# Altium project ARMflash_revC.PrjPcb (part 3 of 4)

## Sheet Pg13_FPGA_Connectors.SchDoc: FPGA CONNECTORS
size A2; DocumentNumber: 13; Revision: C2; SheetNumber: 13; SheetTotal: 16
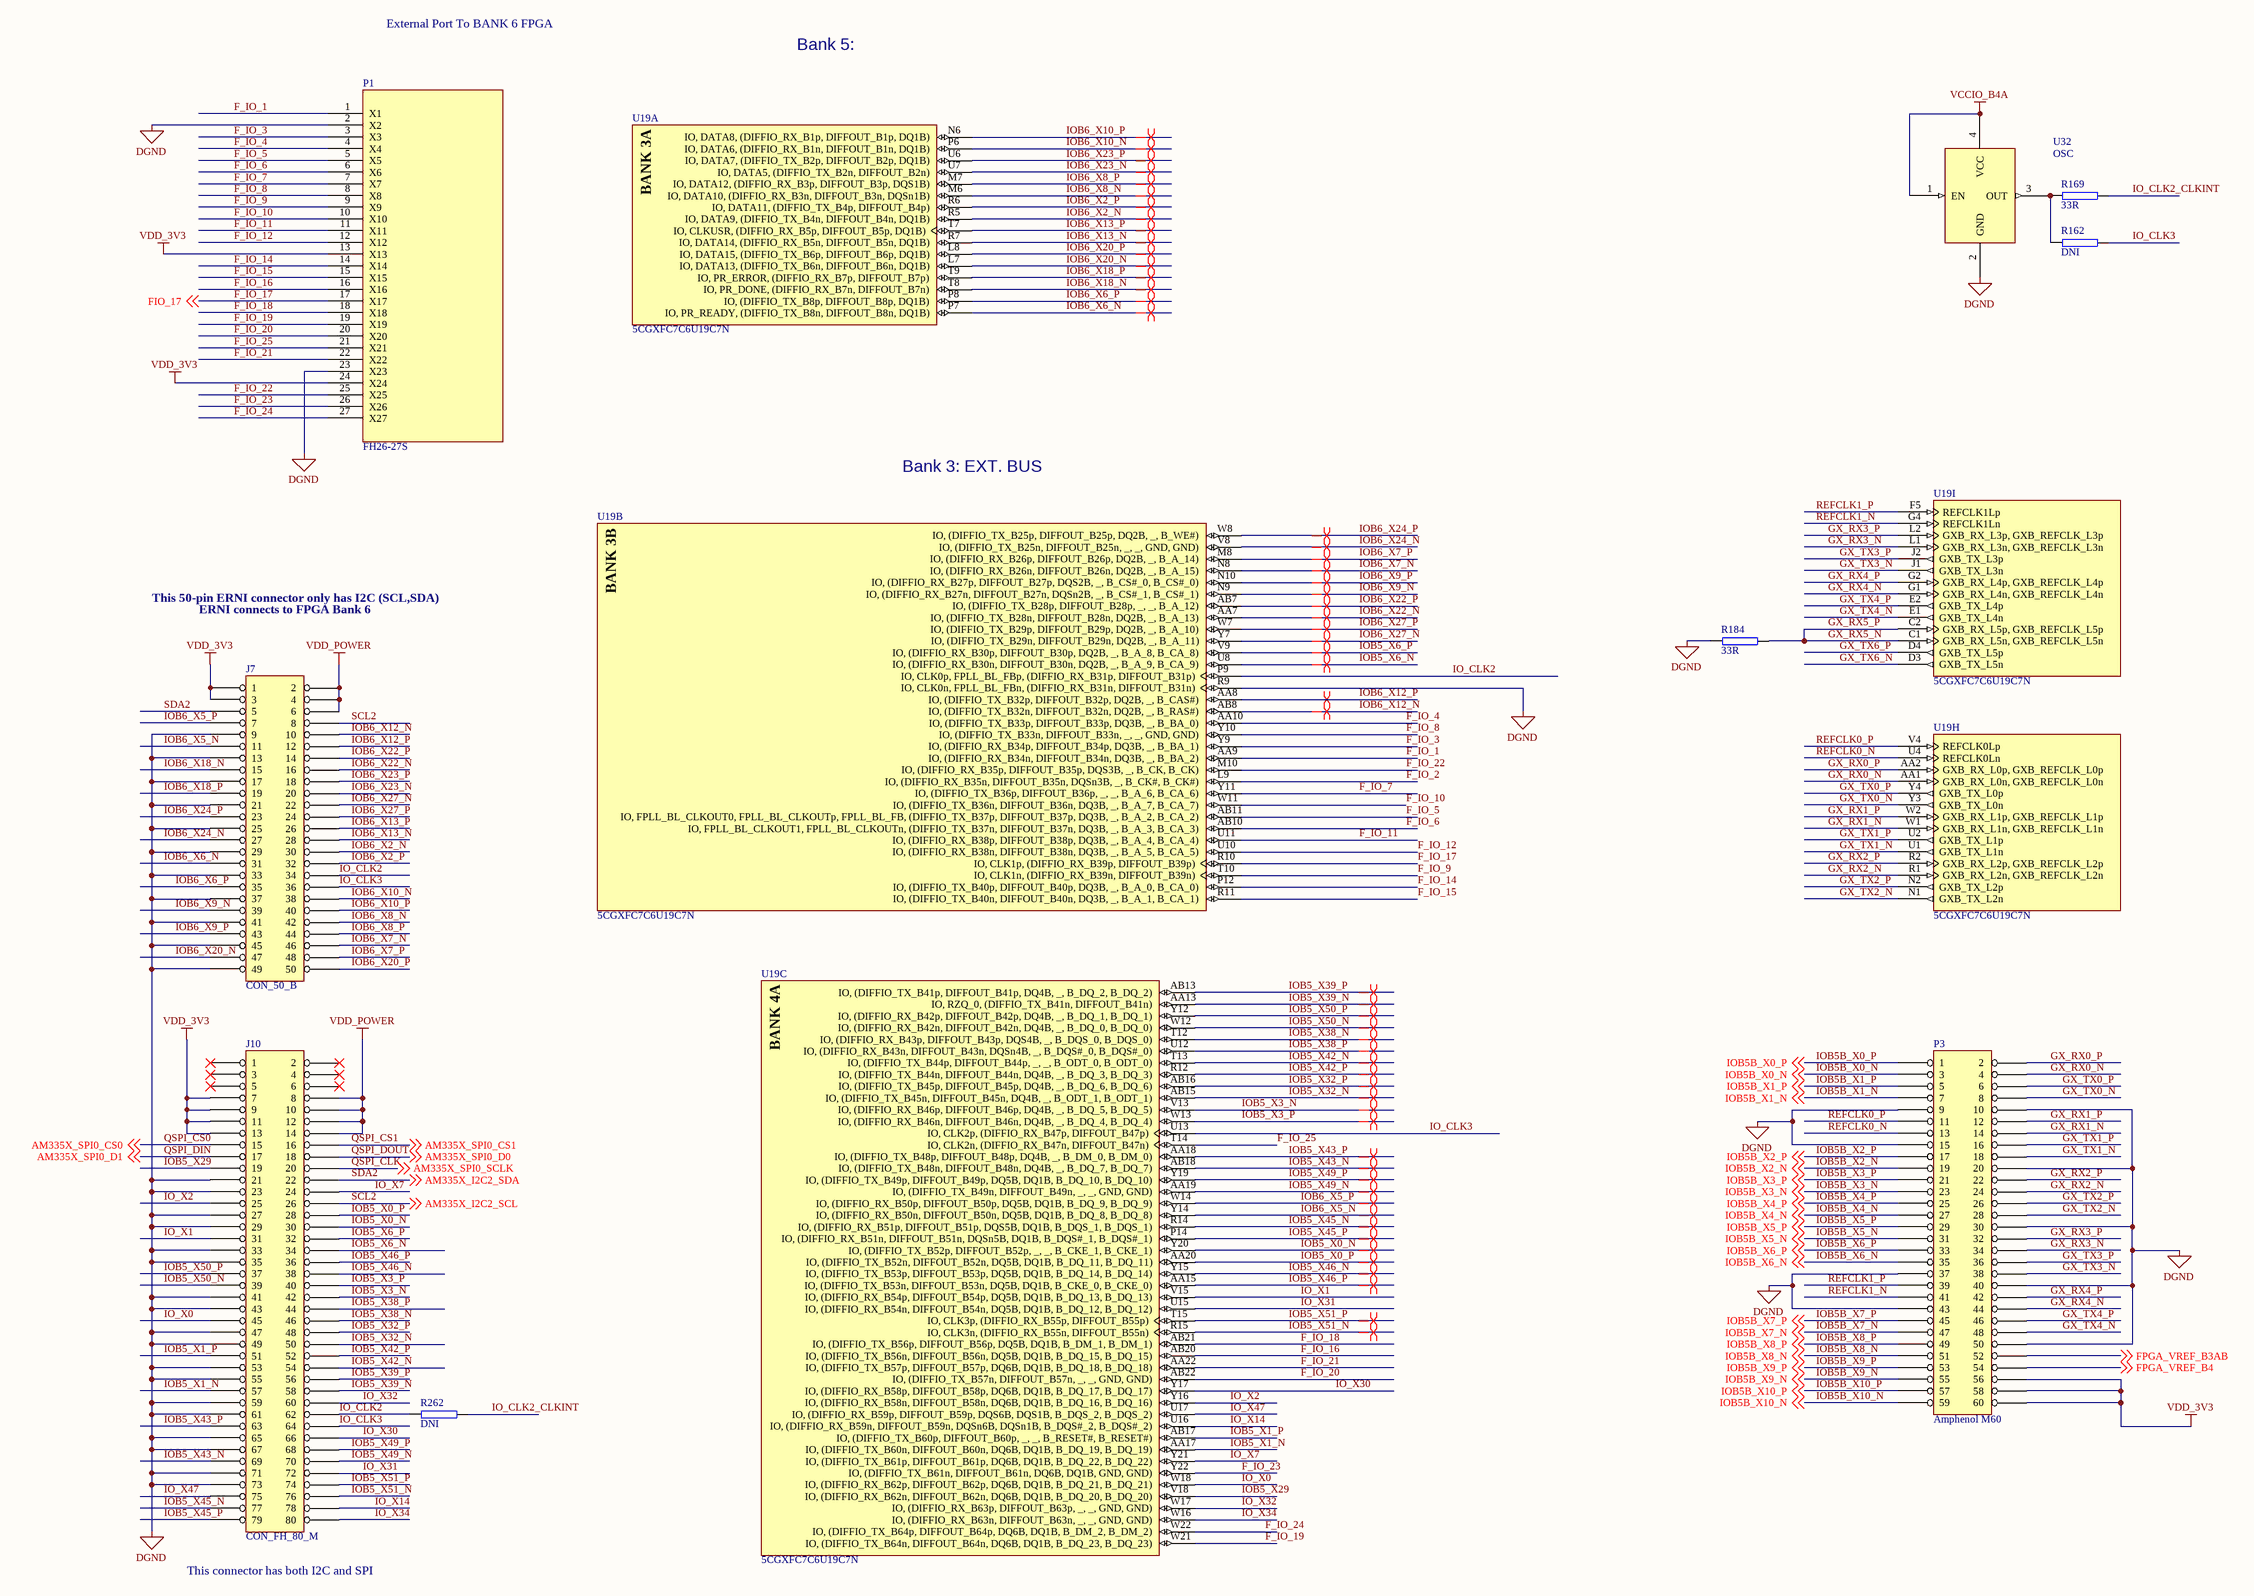
[diagram p15: Pg13_FPGA_Connectors.SchDoc]

### Parts
(Parts that share a designator on the sheet are numbered #1, #2 ... from top to bottom, then left to right.)
?#13  (no value)  (graphical)
J7  CON_50_B  [CON_50_B]
J10  CON_FH_80_M  [CON_FH_80_M]
P1  FH26-27S  [FH26-27S]
P3  Amphenol M60  [CON60_M]
R162  DNI  [sc0402]
R169  33R  [sc0402]
R184  33R  [sc0402]
R262  DNI  [sc0402]
U19  5CGXFC7C6U19C7N  [ALTR-UBGA484_A-190]  (parts A,B,C,H,I of 13)
U32  OSC  [Osc 3.2x2.5]

### Nets
DGND: J7.9 J7.13 J7.17 J7.21 J7.25 J7.29 J7.33 J7.37 J7.41 J7.45 J7.49 J10.21 J10.23 J10.27 J10.29 J10.33 J10.35 J10.41 J10.43 J10.47 J10.49 J10.53 J10.55 J10.59 J10.61 J10.65 J10.67 J10.71 J10.73 P1.2(X2) P1.23(X23) P3.9 P3.10 P3.15 P3.20 P3.30 P3.37 P3.40 P3.43 P3.50 R184.1 U19.R9(IO,_CLK0n,_FPLL_BL_FBn,_(DIFFIO_RX_B31n,_DIFFOUT_B31n)) U32.2(GND)
VCCIO_B4A: U32.1(EN) U32.4(VCC)
VDD_3V3: J7.1 J7.3 J10.7 J10.9 J10.11 J10.13 P1.13(X13) P1.24(X24) P3.56 P3.58 P3.60  [project net VDD]
VDD_POWER: J7.2 J7.4 J7.6 J10.8 J10.10 J10.12 J10.14
AM335X_SPI0_CS0: J10.15 ; off-sheet AM335X_SPI0_CS0  [also labelled QSPI_CS0]
AM335X_SPI0_CS1: J10.16 ; off-sheet AM335X_SPI0_CS1  [also labelled QSPI_CS1]
AM335X_SPI0_D0: J10.18 ; off-sheet AM335X_SPI0_D0  [also labelled QSPI_DOUT]
AM335X_SPI0_D1: J10.17 ; off-sheet AM335X_SPI0_D1  [also labelled QSPI_DIN]
AM335X_SPI0_SCLK: J10.20 ; off-sheet AM335X_SPI0_SCLK  [also labelled QSPI_CLK]
F_IO_1: P1.1(X1) U19.AA9(IO,_(DIFFIO_RX_B34n,_DIFFOUT_B34n,_DQ3B,__,_B_BA_2))
F_IO_2: U19.L9(IO,_(DIFFIO_RX_B35n,_DIFFOUT_B35n,_DQSn3B,__,_B_CK#,_B_CK#))
F_IO_3: P1.3(X3) U19.Y9(IO,_(DIFFIO_RX_B34p,_DIFFOUT_B34p,_DQ3B,__,_B_BA_1))
F_IO_4: P1.4(X4) U19.AA10(IO,_(DIFFIO_TX_B33p,_DIFFOUT_B33p,_DQ3B,__,_B_BA_0))
F_IO_5: P1.5(X5) U19.AB11(IO,_FPLL_BL_CLKOUT0,_FPLL_BL_CLKOUTp,_FPLL_BL_FB,_(DIFFIO_TX_B37p,_DIFFOUT_B37p,_DQ3B,__,_B_A_2,_B_CA_2))
F_IO_6: P1.6(X6) U19.AB10(IO,_FPLL_BL_CLKOUT1,_FPLL_BL_CLKOUTn,_(DIFFIO_TX_B37n,_DIFFOUT_B37n,_DQ3B,__,_B_A_3,_B_CA_3))
F_IO_7: P1.7(X7) U19.Y11(IO,_(DIFFIO_TX_B36p,_DIFFOUT_B36p,__,__,_B_A_6,_B_CA_6))
F_IO_8: P1.8(X8) U19.Y10(IO,_(DIFFIO_TX_B33n,_DIFFOUT_B33n,__,__,_GND,_GND))
F_IO_9: P1.9(X9) U19.T10(IO,_CLK1n,_(DIFFIO_RX_B39n,_DIFFOUT_B39n))
F_IO_10: P1.10(X10) U19.W11(IO,_(DIFFIO_TX_B36n,_DIFFOUT_B36n,_DQ3B,__,_B_A_7,_B_CA_7))
F_IO_11: P1.11(X11) U19.U11(IO,_(DIFFIO_RX_B38p,_DIFFOUT_B38p,_DQ3B,__,_B_A_4,_B_CA_4))
F_IO_12: P1.12(X12) U19.U10(IO,_(DIFFIO_RX_B38n,_DIFFOUT_B38n,_DQ3B,__,_B_A_5,_B_CA_5))
F_IO_14: P1.14(X14) U19.P12(IO,_(DIFFIO_TX_B40p,_DIFFOUT_B40p,_DQ3B,__,_B_A_0,_B_CA_0))
F_IO_15: P1.15(X15) U19.R11(IO,_(DIFFIO_TX_B40n,_DIFFOUT_B40n,_DQ3B,__,_B_A_1,_B_CA_1))
F_IO_16: P1.16(X16) U19.AB20(IO,_(DIFFIO_TX_B56n,_DIFFOUT_B56n,_DQ5B,_DQ1B,_B_DQ_15,_B_DQ_15))
F_IO_17: P1.17(X17) U19.R10(IO,_CLK1p,_(DIFFIO_RX_B39p,_DIFFOUT_B39p)) ; off-sheet FIO_17  [also labelled FIO_17]
F_IO_18: P1.18(X18) U19.AB21(IO,_(DIFFIO_TX_B56p,_DIFFOUT_B56p,_DQ5B,_DQ1B,_B_DM_1,_B_DM_1))
F_IO_19: P1.19(X19) U19.W21(IO,_(DIFFIO_TX_B64n,_DIFFOUT_B64n,_DQ6B,_DQ1B,_B_DQ_23,_B_DQ_23))
F_IO_20: P1.20(X20) U19.AB22(IO,_(DIFFIO_TX_B57n,_DIFFOUT_B57n,__,__,_GND,_GND))
F_IO_21: P1.22(X22) U19.AA22(IO,_(DIFFIO_TX_B57p,_DIFFOUT_B57p,_DQ6B,_DQ1B,_B_DQ_18,_B_DQ_18))
F_IO_22: P1.25(X25) U19.M10(IO,_(DIFFIO_RX_B35p,_DIFFOUT_B35p,_DQS3B,__,_B_CK,_B_CK))
F_IO_23: P1.26(X26) U19.Y22(IO,_(DIFFIO_TX_B61n,_DIFFOUT_B61n,_DQ6B,_DQ1B,_GND,_GND))
F_IO_24: P1.27(X27) U19.W22(IO,_(DIFFIO_TX_B64p,_DIFFOUT_B64p,_DQ6B,_DQ1B,_B_DM_2,_B_DM_2))
F_IO_25: P1.21(X21) U19.T14(IO,_CLK2n,_(DIFFIO_RX_B47n,_DIFFOUT_B47n))
FPGA_VREF_B3AB: P3.52 ; off-sheet FPGA_VREF_B3AB
FPGA_VREF_B4: P3.54 ; off-sheet FPGA_VREF_B4
GX_RX0_N: P3.4 U19.AA1(GXB_RX_L0n,_GXB_REFCLK_L0n)
GX_RX0_P: P3.2 U19.AA2(GXB_RX_L0p,_GXB_REFCLK_L0p)
GX_RX1_N: P3.14 U19.W1(GXB_RX_L1n,_GXB_REFCLK_L1n)
GX_RX1_P: P3.12 U19.W2(GXB_RX_L1p,_GXB_REFCLK_L1p)
GX_RX2_N: P3.24 U19.R1(GXB_RX_L2n,_GXB_REFCLK_L2n)
GX_RX2_P: P3.22 U19.R2(GXB_RX_L2p,_GXB_REFCLK_L2p)
GX_RX3_N: P3.34 U19.L1(GXB_RX_L3n,_GXB_REFCLK_L3n)
GX_RX3_P: P3.32 U19.L2(GXB_RX_L3p,_GXB_REFCLK_L3p)
GX_RX4_N: P3.44 U19.G1(GXB_RX_L4n,_GXB_REFCLK_L4n)
GX_RX4_P: P3.42 U19.G2(GXB_RX_L4p,_GXB_REFCLK_L4p)
GX_RX5_N: R184.2 U19.C1(GXB_RX_L5n,_GXB_REFCLK_L5n) U19.C2(GXB_RX_L5p,_GXB_REFCLK_L5p)  [also labelled GX_RX5_P]
GX_TX0_N: P3.8 U19.Y3(GXB_TX_L0n)
GX_TX0_P: P3.6 U19.Y4(GXB_TX_L0p)
GX_TX1_N: P3.18 U19.U1(GXB_TX_L1n)
GX_TX1_P: P3.16 U19.U2(GXB_TX_L1p)
GX_TX2_N: P3.28 U19.N1(GXB_TX_L2n)
GX_TX2_P: P3.26 U19.N2(GXB_TX_L2p)
GX_TX3_N: P3.38 U19.J1(GXB_TX_L3n)
GX_TX3_P: P3.36 U19.J2(GXB_TX_L3p)
GX_TX4_N: P3.48 U19.E1(GXB_TX_L4n)
GX_TX4_P: P3.46 U19.E2(GXB_TX_L4p)
GX_TX6_N: U19.D3(GXB_TX_L5n)
GX_TX6_P: U19.D4(GXB_TX_L5p)
IO_CLK2: J7.34 J10.62 R262.1 U19.P9(IO,_CLK0p,_FPLL_BL_FBp,_(DIFFIO_RX_B31p,_DIFFOUT_B31p))
IO_CLK2_CLKINT: R169.2 R262.2
IO_CLK3: J7.36 J10.64 R162.2 U19.U13(IO,_CLK2p,_(DIFFIO_RX_B47p,_DIFFOUT_B47p))
IO_X0: J10.45 U19.W18(IO,_(DIFFIO_RX_B62p,_DIFFOUT_B62p,_DQ6B,_DQ1B,_B_DQ_21,_B_DQ_21))
IO_X1: J10.31 U19.V15(IO,_(DIFFIO_RX_B54p,_DIFFOUT_B54p,_DQ5B,_DQ1B,_B_DQ_13,_B_DQ_13))
IO_X2: J10.25 U19.Y16(IO,_(DIFFIO_RX_B58n,_DIFFOUT_B58n,_DQ6B,_DQ1B,_B_DQ_16,_B_DQ_16))
IO_X7: J10.24 U19.Y21(IO,_(DIFFIO_TX_B61p,_DIFFOUT_B61p,_DQ6B,_DQ1B,_B_DQ_22,_B_DQ_22))
IO_X14: J10.78 U19.U16(IO,_(DIFFIO_RX_B59n,_DIFFOUT_B59n,_DQSn6B,_DQSn1B,_B_DQS#_2,_B_DQS#_2))
IO_X30: J10.66 U19.Y17(IO,_(DIFFIO_RX_B58p,_DIFFOUT_B58p,_DQ6B,_DQ1B,_B_DQ_17,_B_DQ_17))
IO_X31: J10.72 U19.U15(IO,_(DIFFIO_RX_B54n,_DIFFOUT_B54n,_DQ5B,_DQ1B,_B_DQ_12,_B_DQ_12))
IO_X32: J10.60 U19.W17(IO,_(DIFFIO_RX_B63p,_DIFFOUT_B63p,__,__,_GND,_GND))
IO_X34: J10.80 U19.W16(IO,_(DIFFIO_RX_B63n,_DIFFOUT_B63n,__,__,_GND,_GND))
IO_X47: J10.75 U19.U17(IO,_(DIFFIO_RX_B59p,_DIFFOUT_B59p,_DQS6B,_DQS1B,_B_DQS_2,_B_DQS_2))
IOB5_X0_N: J10.30 U19.Y20(IO,_(DIFFIO_TX_B52p,_DIFFOUT_B52p,__,__,_B_CKE_1,_B_CKE_1))
IOB5_X0_P: J10.28 U19.AA20(IO,_(DIFFIO_TX_B52n,_DIFFOUT_B52n,_DQ5B,_DQ1B,_B_DQ_11,_B_DQ_11))
IOB5_X1_N: J10.57 U19.AA17(IO,_(DIFFIO_TX_B60n,_DIFFOUT_B60n,_DQ6B,_DQ1B,_B_DQ_19,_B_DQ_19))
IOB5_X1_P: J10.51 U19.AB17(IO,_(DIFFIO_TX_B60p,_DIFFOUT_B60p,__,__,_B_RESET#,_B_RESET#))
IOB5_X3_N: J10.42 U19.V13(IO,_(DIFFIO_RX_B46p,_DIFFOUT_B46p,_DQ4B,__,_B_DQ_5,_B_DQ_5))
IOB5_X3_P: J10.40 U19.W13(IO,_(DIFFIO_RX_B46n,_DIFFOUT_B46n,_DQ4B,__,_B_DQ_4,_B_DQ_4))
IOB5_X6_N: J10.34 U19.U8(IO,_(DIFFIO_RX_B30n,_DIFFOUT_B30n,_DQ2B,__,_B_A_9,_B_CA_9))
IOB5_X6_P: J10.32 U19.V9(IO,_(DIFFIO_RX_B30p,_DIFFOUT_B30p,_DQ2B,__,_B_A_8,_B_CA_8))
IOB5_X29: J10.19 U19.V18(IO,_(DIFFIO_RX_B62n,_DIFFOUT_B62n,_DQ6B,_DQ1B,_B_DQ_20,_B_DQ_20))
IOB5_X32_N: J10.50 U19.AB15(IO,_(DIFFIO_TX_B45n,_DIFFOUT_B45n,_DQ4B,__,_B_ODT_1,_B_ODT_1))
IOB5_X32_P: J10.48 U19.AB16(IO,_(DIFFIO_TX_B45p,_DIFFOUT_B45p,_DQ4B,__,_B_DQ_6,_B_DQ_6))
IOB5_X38_N: J10.46 U19.T12(IO,_(DIFFIO_RX_B43p,_DIFFOUT_B43p,_DQS4B,__,_B_DQS_0,_B_DQS_0))
IOB5_X38_P: J10.44 U19.U12(IO,_(DIFFIO_RX_B43n,_DIFFOUT_B43n,_DQSn4B,__,_B_DQS#_0,_B_DQS#_0))
IOB5_X39_N: J10.58 U19.AA13(IO,_RZQ_0,_(DIFFIO_TX_B41n,_DIFFOUT_B41n))
IOB5_X39_P: J10.56 U19.AB13(IO,_(DIFFIO_TX_B41p,_DIFFOUT_B41p,_DQ4B,__,_B_DQ_2,_B_DQ_2))
IOB5_X42_N: J10.54 U19.T13(IO,_(DIFFIO_TX_B44p,_DIFFOUT_B44p,__,__,_B_ODT_0,_B_ODT_0))
IOB5_X42_P: J10.52 U19.R12(IO,_(DIFFIO_TX_B44n,_DIFFOUT_B44n,_DQ4B,__,_B_DQ_3,_B_DQ_3))
IOB5_X43_N: J10.69 U19.AB18(IO,_(DIFFIO_TX_B48n,_DIFFOUT_B48n,_DQ4B,__,_B_DQ_7,_B_DQ_7))
IOB5_X43_P: J10.63 U19.AA18(IO,_(DIFFIO_TX_B48p,_DIFFOUT_B48p,_DQ4B,__,_B_DM_0,_B_DM_0))
IOB5_X45_N: J10.77 U19.R14(IO,_(DIFFIO_RX_B51p,_DIFFOUT_B51p,_DQS5B,_DQ1B,_B_DQS_1,_B_DQS_1))
IOB5_X45_P: J10.79 U19.P14(IO,_(DIFFIO_RX_B51n,_DIFFOUT_B51n,_DQSn5B,_DQ1B,_B_DQS#_1,_B_DQS#_1))
IOB5_X46_N: J10.38 U19.Y15(IO,_(DIFFIO_TX_B53p,_DIFFOUT_B53p,_DQ5B,_DQ1B,_B_DQ_14,_B_DQ_14))
IOB5_X46_P: J10.36 U19.AA15(IO,_(DIFFIO_TX_B53n,_DIFFOUT_B53n,_DQ5B,_DQ1B,_B_CKE_0,_B_CKE_0))
IOB5_X49_N: J10.70 U19.AA19(IO,_(DIFFIO_TX_B49n,_DIFFOUT_B49n,__,__,_GND,_GND))
IOB5_X49_P: J10.68 U19.Y19(IO,_(DIFFIO_TX_B49p,_DIFFOUT_B49p,_DQ5B,_DQ1B,_B_DQ_10,_B_DQ_10))
IOB5_X50_N: J10.39 U19.W12(IO,_(DIFFIO_RX_B42n,_DIFFOUT_B42n,_DQ4B,__,_B_DQ_0,_B_DQ_0))
IOB5_X50_P: J10.37 U19.Y12(IO,_(DIFFIO_RX_B42p,_DIFFOUT_B42p,_DQ4B,__,_B_DQ_1,_B_DQ_1))
IOB5_X51_N: J10.76 U19.R15(IO,_CLK3n,_(DIFFIO_RX_B55n,_DIFFOUT_B55n))
IOB5_X51_P: J10.74 U19.T15(IO,_CLK3p,_(DIFFIO_RX_B55p,_DIFFOUT_B55p))
IOB5B_X0_N: P3.3 ; off-sheet IOB5B_X0_N
IOB5B_X0_P: P3.1 ; off-sheet IOB5B_X0_P
IOB5B_X1_N: P3.7 ; off-sheet IOB5B_X1_N
IOB5B_X1_P: P3.5 ; off-sheet IOB5B_X1_P
IOB5B_X2_N: P3.19 ; off-sheet IOB5B_X2_N
IOB5B_X2_P: P3.17 ; off-sheet IOB5B_X2_P
IOB5B_X3_N: P3.23 ; off-sheet IOB5B_X3_N
IOB5B_X3_P: P3.21 ; off-sheet IOB5B_X3_P
IOB5B_X4_N: P3.27 ; off-sheet IOB5B_X4_N
IOB5B_X4_P: P3.25 ; off-sheet IOB5B_X4_P
IOB5B_X5_N: P3.31 ; off-sheet IOB5B_X5_N
IOB5B_X5_P: P3.29 ; off-sheet IOB5B_X5_P
IOB5B_X6_N: P3.35 ; off-sheet IOB5B_X6_N
IOB5B_X6_P: P3.33 ; off-sheet IOB5B_X6_P
IOB5B_X7_N: P3.47 ; off-sheet IOB5B_X7_N
IOB5B_X7_P: P3.45 ; off-sheet IOB5B_X7_P
IOB5B_X8_N: P3.51 ; off-sheet IOB5B_X8_N
IOB5B_X8_P: P3.49 ; off-sheet IOB5B_X8_P
IOB5B_X9_N: P3.55 ; off-sheet IOB5B_X9_N
IOB5B_X9_P: P3.53 ; off-sheet IOB5B_X9_P
IOB5B_X10_N: P3.59 ; off-sheet IOB5B_X10_N
IOB5B_X10_P: P3.57 ; off-sheet IOB5B_X10_P
IOB6_X2_N: J7.30 U19.R5(IO,_DATA9,_(DIFFIO_TX_B4n,_DIFFOUT_B4n,_DQ1B))
IOB6_X2_P: J7.32 U19.R6(IO,_DATA11,_(DIFFIO_TX_B4p,_DIFFOUT_B4p))
IOB6_X5_N: J7.11 U19.Y14(IO,_(DIFFIO_RX_B50n,_DIFFOUT_B50n,_DQ5B,_DQ1B,_B_DQ_8,_B_DQ_8))
IOB6_X5_P: J7.7 U19.W14(IO,_(DIFFIO_RX_B50p,_DIFFOUT_B50p,_DQ5B,_DQ1B,_B_DQ_9,_B_DQ_9))
IOB6_X6_N: J7.31 U19.P7(IO,_PR_READY,_(DIFFIO_TX_B8n,_DIFFOUT_B8n,_DQ1B))
IOB6_X6_P: J7.35 U19.P8(IO,_(DIFFIO_TX_B8p,_DIFFOUT_B8p,_DQ1B))
IOB6_X7_N: J7.46 U19.N8(IO,_(DIFFIO_RX_B26n,_DIFFOUT_B26n,_DQ2B,__,_B_A_15))
IOB6_X7_P: J7.48 U19.M8(IO,_(DIFFIO_RX_B26p,_DIFFOUT_B26p,_DQ2B,__,_B_A_14))
IOB6_X8_N: J7.42 U19.M6(IO,_DATA10,_(DIFFIO_RX_B3n,_DIFFOUT_B3n,_DQSn1B))
IOB6_X8_P: J7.44 U19.M7(IO,_DATA12,_(DIFFIO_RX_B3p,_DIFFOUT_B3p,_DQS1B))
IOB6_X9_N: J7.39 U19.N9(IO,_(DIFFIO_RX_B27n,_DIFFOUT_B27n,_DQSn2B,__,_B_CS#_1,_B_CS#_1))
IOB6_X9_P: J7.43 U19.N10(IO,_(DIFFIO_RX_B27p,_DIFFOUT_B27p,_DQS2B,__,_B_CS#_0,_B_CS#_0))
IOB6_X10_N: J7.38 U19.P6(IO,_DATA6,_(DIFFIO_RX_B1n,_DIFFOUT_B1n,_DQ1B))
IOB6_X10_P: J7.40 U19.N6(IO,_DATA8,_(DIFFIO_RX_B1p,_DIFFOUT_B1p,_DQ1B))
IOB6_X12_N: J7.10 U19.AB8(IO,_(DIFFIO_TX_B32n,_DIFFOUT_B32n,_DQ2B,__,_B_RAS#))
IOB6_X12_P: J7.12 U19.AA8(IO,_(DIFFIO_TX_B32p,_DIFFOUT_B32p,_DQ2B,__,_B_CAS#))
IOB6_X13_N: J7.28 U19.R7(IO,_DATA14,_(DIFFIO_RX_B5n,_DIFFOUT_B5n,_DQ1B))
IOB6_X13_P: J7.26 U19.T7(IO,_CLKUSR,_(DIFFIO_RX_B5p,_DIFFOUT_B5p,_DQ1B))
IOB6_X18_N: J7.15 U19.T8(IO,_PR_DONE,_(DIFFIO_RX_B7n,_DIFFOUT_B7n))
IOB6_X18_P: J7.19 U19.T9(IO,_PR_ERROR,_(DIFFIO_RX_B7p,_DIFFOUT_B7p))
IOB6_X20_N: J7.47 U19.L7(IO,_DATA13,_(DIFFIO_TX_B6n,_DIFFOUT_B6n,_DQ1B))
IOB6_X20_P: J7.50 U19.L8(IO,_DATA15,_(DIFFIO_TX_B6p,_DIFFOUT_B6p,_DQ1B))
IOB6_X22_N: J7.16 U19.AA7(IO,_(DIFFIO_TX_B28n,_DIFFOUT_B28n,_DQ2B,__,_B_A_13))
IOB6_X22_P: J7.14 U19.AB7(IO,_(DIFFIO_TX_B28p,_DIFFOUT_B28p,__,__,_B_A_12))
IOB6_X23_N: J7.20 U19.U7(IO,_DATA5,_(DIFFIO_TX_B2n,_DIFFOUT_B2n))
IOB6_X23_P: J7.18 U19.U6(IO,_DATA7,_(DIFFIO_TX_B2p,_DIFFOUT_B2p,_DQ1B))
IOB6_X24_N: J7.27 U19.V8(IO,_(DIFFIO_TX_B25n,_DIFFOUT_B25n,__,__,_GND,_GND))
IOB6_X24_P: J7.23 U19.W8(IO,_(DIFFIO_TX_B25p,_DIFFOUT_B25p,_DQ2B,__,_B_WE#))
IOB6_X27_N: J7.22 U19.Y7(IO,_(DIFFIO_TX_B29n,_DIFFOUT_B29n,_DQ2B,__,_B_A_11))
IOB6_X27_P: J7.24 U19.W7(IO,_(DIFFIO_TX_B29p,_DIFFOUT_B29p,_DQ2B,__,_B_A_10))
REFCLK0_N: P3.13 U19.U4(REFCLK0Ln)
REFCLK0_P: P3.11 U19.V4(REFCLK0Lp)
REFCLK1_N: P3.41 U19.G4(REFCLK1Ln)
REFCLK1_P: P3.39 U19.F5(REFCLK1Lp)
SCL2: J7.8 J10.26 ; off-sheet AM335X_I2C2_SCL  [also labelled AM335X_I2C2_SCL]
SDA2: J7.5 J10.22 ; off-sheet AM335X_I2C2_SDA  [also labelled AM335X_I2C2_SDA]
NetR162_1: R162.1 R169.1 U32.3(OUT)

Not connected (* = marked no-connect by the designer): J10 1* 2* 3* 4* 5* 6*

### Layout directives
differential pair: IOB5_X0_N, IOB5_X0_P, IOB5_X3_N, IOB5_X3_P, IOB5_X6_N, IOB5_X6_P, IOB5_X32_N, IOB5_X32_P, IOB5_X38_N, IOB5_X38_P, IOB5_X39_N, IOB5_X39_P, IOB5_X42_N, IOB5_X42_P, IOB5_X43_N, IOB5_X43_P, IOB5_X45_N, IOB5_X45_P, IOB5_X46_N, IOB5_X46_P, IOB5_X49_N, IOB5_X49_P, IOB5_X50_N, IOB5_X50_P, IOB5_X51_N, IOB5_X51_P, IOB6_X2_N, IOB6_X2_P, IOB6_X5_N, IOB6_X5_P, IOB6_X6_N, IOB6_X6_P, IOB6_X7_N, IOB6_X7_P, IOB6_X8_N, IOB6_X8_P, IOB6_X9_N, IOB6_X9_P, IOB6_X10_N, IOB6_X10_P, IOB6_X12_N, IOB6_X12_P, IOB6_X13_N, IOB6_X13_P, IOB6_X18_N, IOB6_X18_P, IOB6_X20_N, IOB6_X20_P, IOB6_X22_N, IOB6_X22_P, IOB6_X23_N, IOB6_X23_P, IOB6_X24_N, IOB6_X24_P, IOB6_X27_N, IOB6_X27_P

### Notes on the sheet
- External Port To BANK 6 FPGA
- Bank 5:
- Bank 3: EXT. BUS
- This 50-pin ERNI connector only has I2C (SCL,SDA)
- ERNI connects to FPGA Bank 6
- (near J10) This connector has both I2C and SPI
- Embedded Vision Systems Group
- Title
- School of Electrical and Electronic Engineering
- Date:
- Size
- Document Number
- Sheet
- of
- Rev
- (in symbol 5CGXFC7C6U19C7N, part A) BANK 3A
- (in symbol 5CGXFC7C6U19C7N, part B) BANK 3B
- (in symbol 5CGXFC7C6U19C7N, part C) BANK 4A

### Library data of the parts
?#13 = Title Block Address(1): UoM title block
J7 = CON_50_B: HEADER 25X2
J10 = CON_FH_80_M: AMPHENOL FH
P1 = FH26-27S: Flexible PCB connector
P3 = CON60_FH_M: Header vertical 60 M; Farnell: 1098336
R162 R169 R184 R262 = RES: Resistor
U19 = 5CGXFC7C6U19C7N: Cyclone V GX Family FPGA, 1.07 to 1.13 V Supply, 240 I/O Pins, 7 PLLs, 484-Pin UBGA, Speed Grade 7, Commercial Grade, RoHS Compliant; Manufacturer: Altera; GPIO: 240; Logic Elements (LE) (K): 149.5; Speed Grade: 7; DatasheetVersion: Rev. 3.4; PackageVersion: Rev. 1.0, 12/2011; PackageReference: UBGA484_A-190; PackageDescription: 484-Pin Ultra FineLine Ball-Grid Array (UBGA), Body 19 x 19 mm, Pitch 0.8 mm; Supplier 1: Digi-Key; Supplier Part Number 1: 5CGXFC7C6U19C7N-ND; Supplier 2: Mouser; Supplier Part Number 2: 989-5CGXFC7C6U19C7N; Device Group: 5CGXFC7; RoHS: RoHS Compliant; Subcategory: Cyclone V GX; Voltage Supply: 1.07 to 1.13 V; NexusDeviceID: 5CGXFC7C6U19C7N; Mounting Technology: Surface Mount; Code_JEDEC: MO-275-PPAA-2; PartNumber: 5CGXFC7C6U19C7N; ComponentLink1Description: Manufacturer URL; ComponentLink1URL: http://www.altera.com; ComponentLink2Description: Datasheet; ComponentLink2URL: http://www.altera.com/literature/hb/cyclone-v/cv_51002.pdf; ComponentLink3Description: Package Specification; ComponentLink3URL: http://www.altera.com/devicepackaging/04R00436-01.pdf; ComponentLink4Description: Device Handbook URL; ComponentLink4URL: http://www.altera.com/literature/hb/cyclone-v/cyclone5_handbook.pdf; ComponentLink5Description: Device Pin-Out URL; ComponentLink5URL: http://www.altera.com/literature/dp/cyclone-v/5CGXFC7.xls; ComponentLink6Description: Device Overview URL; ComponentLink6URL: http://www.altera.com/literature/hb/cyclone-v/cv_51001.pdf; ComponentLink7Description: Product URL; ComponentLink7URL: http://www.buyaltera.com/scripts/partsearch.dll?Detail&name=5CGXFC7C6U19C7N-ND
U32 = OSC: XTAL OSCILLATOR MODULE

## Sheet Pg14_FPGA_DDR3.SchDoc: FPGA MEMORY -DDR2
size A2; DocumentNumber: 14; Revision: C2; SheetNumber: 14; SheetTotal: 16
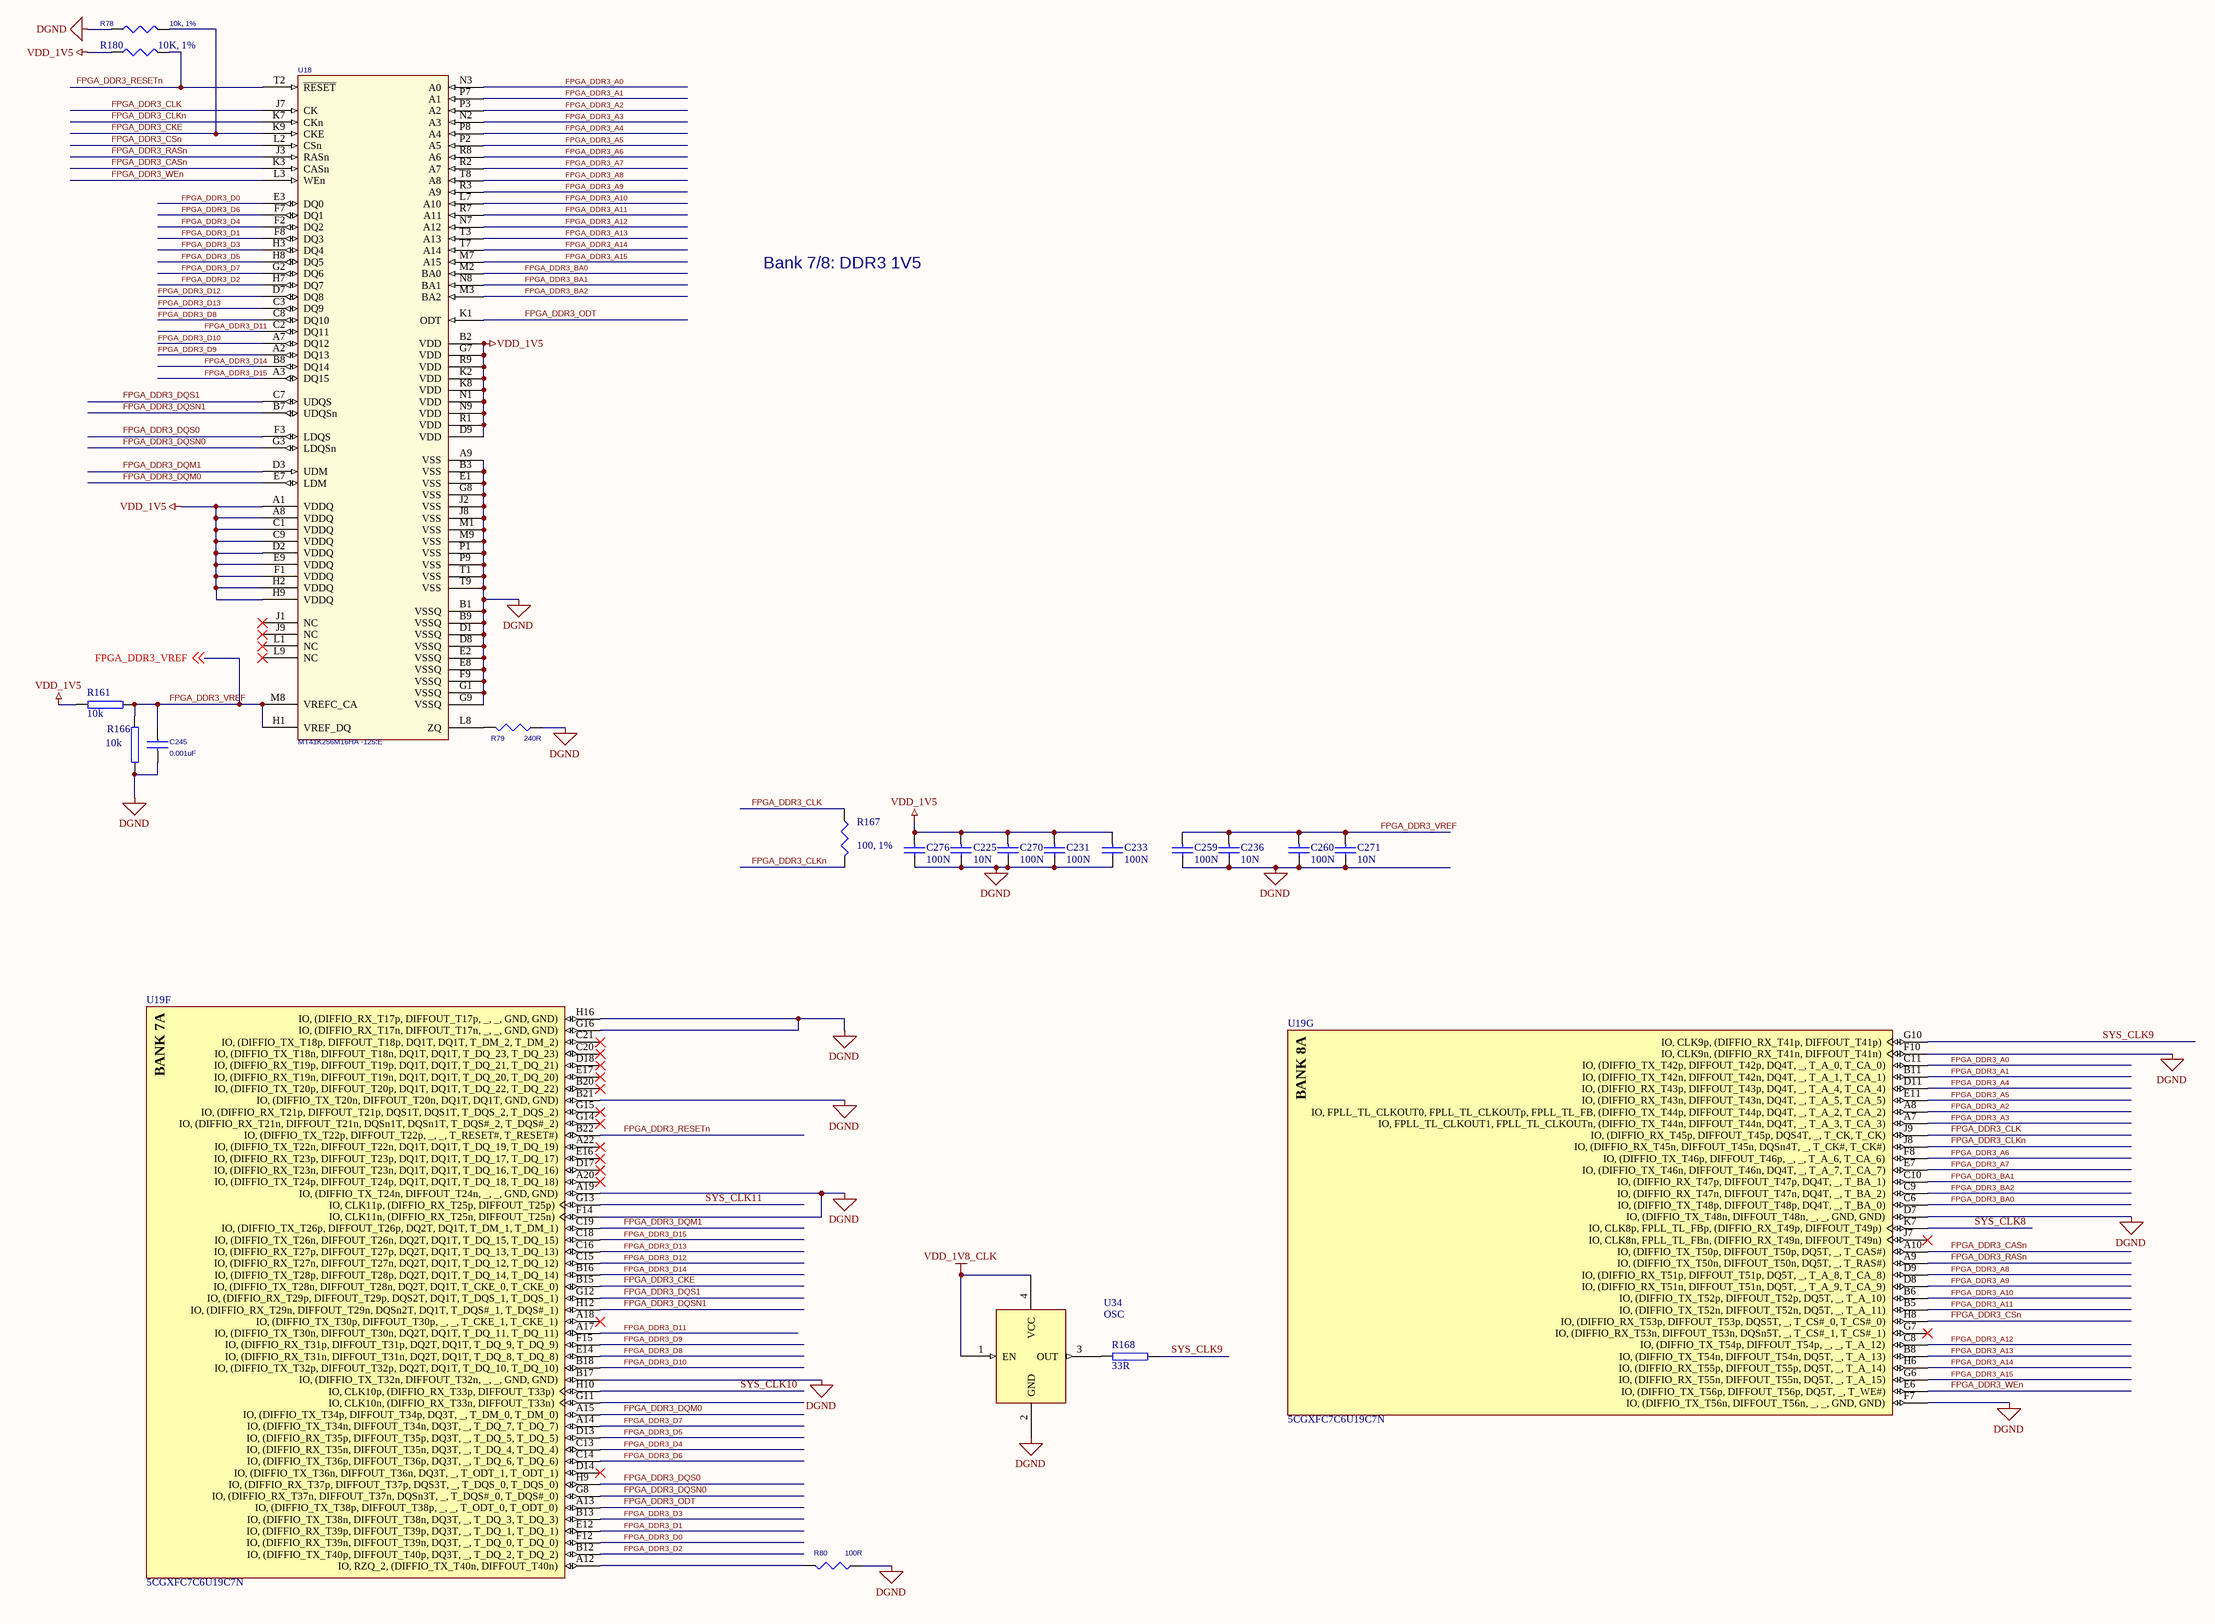
[diagram p16: Pg14_FPGA_DDR3.SchDoc]

### Parts
(Parts that share a designator on the sheet are numbered #1, #2 ... from top to bottom, then left to right.)
?#14  (no value)  (graphical)
C225  10N  [sc0402]
C231  100N  [sc0402]
C233  100N  [sc0402]
C236  10N  [sc0402]
C245  0.001uF  [SM-7351-CAP-0402]
C259  100N  [sc0402]
C260  100N  [0603]
C270  100N  [sc0402]
C271  10N  [sc0402]
C276  100N  [sc0402]
R78  10k, 1%  [sm-7351-res-0402 - duplicate]
R79  240R  [SM-7351-RES-0402]
R80  100R  [SM-7351-RES-0402]
R161  10k  [0603]
R166  10k  [0603]
R167  100, 1%  [sc0402]
R168  33R  [sc0402]
R180  10K, 1%  [sc0402]
U18  MT41K256M16HA -125:E  [BGA14X10-96]
U19  5CGXFC7C6U19C7N  [ALTR-UBGA484_A-190]  (parts F,G of 13)
U34  OSC  [Osc 3.2x2.5]

### Nets
DGND: C225.2 C231.2 C233.2 C236.2 C245.2 C259.2 C260.2 C270.2 C271.2 C276.2 R78.1 R79.2(P2) R80.2(P2) R166.2 U18.A9(VSS) U18.B1(VSSQ) U18.B3(VSS) U18.B9(VSSQ) U18.D1(VSSQ) U18.D8(VSSQ) U18.E1(VSS) U18.E2(VSSQ) U18.E8(VSSQ) U18.F9(VSSQ) U18.G1(VSSQ) U18.G8(VSS) U18.G9(VSSQ) U18.J2(VSS) U18.J8(VSS) U18.M1(VSS) U18.M9(VSS) U18.P1(VSS) U18.P9(VSS) U18.T1(VSS) U18.T9(VSS) U19.A19(IO,_(DIFFIO_TX_T24n,_DIFFOUT_T24n,__,__,_GND,_GND)) U19.B17(IO,_(DIFFIO_TX_T32n,_DIFFOUT_T32n,__,__,_GND,_GND)) U19.B21(IO,_(DIFFIO_TX_T20n,_DIFFOUT_T20n,_DQ1T,_DQ1T,_GND,_GND)) U19.D7(IO,_(DIFFIO_TX_T48n,_DIFFOUT_T48n,__,__,_GND,_GND)) U19.F7(IO,_(DIFFIO_TX_T56n,_DIFFOUT_T56n,__,__,_GND,_GND)) U19.F10(IO,_CLK9n,_(DIFFIO_RX_T41n,_DIFFOUT_T41n)) U19.F14(IO,_CLK11n,_(DIFFIO_RX_T25n,_DIFFOUT_T25n)) U19.G16(IO,_(DIFFIO_RX_T17n,_DIFFOUT_T17n,__,__,_GND,_GND)) U19.H16(IO,_(DIFFIO_RX_T17p,_DIFFOUT_T17p,__,__,_GND,_GND)) U34.2(GND)
VDD_1V5: C225.1 C231.1 C233.1 C270.1 C276.1 R161.1 R180.1 U18.A1(VDDQ) U18.A8(VDDQ) U18.B2(VDD) U18.C1(VDDQ) U18.C9(VDDQ) U18.D2(VDDQ) U18.D9(VDD) U18.E9(VDDQ) U18.F1(VDDQ) U18.G7(VDD) U18.H2(VDDQ) U18.H9(VDDQ) U18.K2(VDD) U18.K8(VDD) U18.N1(VDD) U18.N9(VDD) U18.R1(VDD) U18.R9(VDD)
VDD_1V8_CLK: U34.1(EN) U34.4(VCC)
FPGA_DDR3_A0: U18.N3(A0) U19.C11(IO,_(DIFFIO_TX_T42p,_DIFFOUT_T42p,_DQ4T,__,_T_A_0,_T_CA_0))
FPGA_DDR3_A1: U18.P7(A1) U19.B11(IO,_(DIFFIO_TX_T42n,_DIFFOUT_T42n,_DQ4T,__,_T_A_1,_T_CA_1))
FPGA_DDR3_A2: U18.P3(A2) U19.A8(IO,_FPLL_TL_CLKOUT0,_FPLL_TL_CLKOUTp,_FPLL_TL_FB,_(DIFFIO_TX_T44p,_DIFFOUT_T44p,_DQ4T,__,_T_A_2,_T_CA_2))
FPGA_DDR3_A3: U18.N2(A3) U19.A7(IO,_FPLL_TL_CLKOUT1,_FPLL_TL_CLKOUTn,_(DIFFIO_TX_T44n,_DIFFOUT_T44n,_DQ4T,__,_T_A_3,_T_CA_3))
FPGA_DDR3_A4: U18.P8(A4) U19.D11(IO,_(DIFFIO_RX_T43p,_DIFFOUT_T43p,_DQ4T,__,_T_A_4,_T_CA_4))
FPGA_DDR3_A5: U18.P2(A5) U19.E11(IO,_(DIFFIO_RX_T43n,_DIFFOUT_T43n,_DQ4T,__,_T_A_5,_T_CA_5))
FPGA_DDR3_A6: U18.R8(A6) U19.F8(IO,_(DIFFIO_TX_T46p,_DIFFOUT_T46p,__,__,_T_A_6,_T_CA_6))
FPGA_DDR3_A7: U18.R2(A7) U19.E7(IO,_(DIFFIO_TX_T46n,_DIFFOUT_T46n,_DQ4T,__,_T_A_7,_T_CA_7))
FPGA_DDR3_A8: U18.T8(A8) U19.D9(IO,_(DIFFIO_RX_T51p,_DIFFOUT_T51p,_DQ5T,__,_T_A_8,_T_CA_8))
FPGA_DDR3_A9: U18.R3(A9) U19.D8(IO,_(DIFFIO_RX_T51n,_DIFFOUT_T51n,_DQ5T,__,_T_A_9,_T_CA_9))
FPGA_DDR3_A10: U18.L7(A10) U19.B6(IO,_(DIFFIO_TX_T52p,_DIFFOUT_T52p,_DQ5T,__,_T_A_10))
FPGA_DDR3_A11: U18.R7(A11) U19.B5(IO,_(DIFFIO_TX_T52n,_DIFFOUT_T52n,_DQ5T,__,_T_A_11))
FPGA_DDR3_A12: U18.N7(A12) U19.C8(IO,_(DIFFIO_TX_T54p,_DIFFOUT_T54p,__,__,_T_A_12))
FPGA_DDR3_A13: U18.T3(A13) U19.B8(IO,_(DIFFIO_TX_T54n,_DIFFOUT_T54n,_DQ5T,__,_T_A_13))
FPGA_DDR3_A14: U18.T7(A14) U19.H6(IO,_(DIFFIO_RX_T55p,_DIFFOUT_T55p,_DQ5T,__,_T_A_14))
FPGA_DDR3_A15: U18.M7(A15) U19.G6(IO,_(DIFFIO_RX_T55n,_DIFFOUT_T55n,_DQ5T,__,_T_A_15))
FPGA_DDR3_BA0: U18.M2(BA0) U19.C6(IO,_(DIFFIO_TX_T48p,_DIFFOUT_T48p,_DQ4T,__,_T_BA_0))
FPGA_DDR3_BA1: U18.N8(BA1) U19.C10(IO,_(DIFFIO_RX_T47p,_DIFFOUT_T47p,_DQ4T,__,_T_BA_1))
FPGA_DDR3_BA2: U18.M3(BA2) U19.C9(IO,_(DIFFIO_RX_T47n,_DIFFOUT_T47n,_DQ4T,__,_T_BA_2))
FPGA_DDR3_CASn: U18.K3(CASn) U19.A10(IO,_(DIFFIO_TX_T50p,_DIFFOUT_T50p,_DQ5T,__,_T_CAS#))
FPGA_DDR3_CKE: R78.2 U18.K9(CKE) U19.B15(IO,_(DIFFIO_TX_T28n,_DIFFOUT_T28n,_DQ2T,_DQ1T,_T_CKE_0,_T_CKE_0))
FPGA_DDR3_CLK: R167.1 U18.J7(CK) U19.J9(IO,_(DIFFIO_RX_T45p,_DIFFOUT_T45p,_DQS4T,__,_T_CK,_T_CK))
FPGA_DDR3_CLKn: R167.2 U18.K7(CKn) U19.J8(IO,_(DIFFIO_RX_T45n,_DIFFOUT_T45n,_DQSn4T,__,_T_CK#,_T_CK#))
FPGA_DDR3_CSn: U18.L2(CSn) U19.H8(IO,_(DIFFIO_RX_T53p,_DIFFOUT_T53p,_DQS5T,__,_T_CS#_0,_T_CS#_0))
FPGA_DDR3_D0: U18.E3(DQ0) U19.F12(IO,_(DIFFIO_RX_T39n,_DIFFOUT_T39n,_DQ3T,__,_T_DQ_0,_T_DQ_0))
FPGA_DDR3_D1: U18.F8(DQ3) U19.E12(IO,_(DIFFIO_RX_T39p,_DIFFOUT_T39p,_DQ3T,__,_T_DQ_1,_T_DQ_1))
FPGA_DDR3_D2: U18.H7(DQ7) U19.B12(IO,_(DIFFIO_TX_T40p,_DIFFOUT_T40p,_DQ3T,__,_T_DQ_2,_T_DQ_2))
FPGA_DDR3_D3: U18.H3(DQ4) U19.B13(IO,_(DIFFIO_TX_T38n,_DIFFOUT_T38n,_DQ3T,__,_T_DQ_3,_T_DQ_3))
FPGA_DDR3_D4: U18.F2(DQ2) U19.C13(IO,_(DIFFIO_RX_T35n,_DIFFOUT_T35n,_DQ3T,__,_T_DQ_4,_T_DQ_4))
FPGA_DDR3_D5: U18.H8(DQ5) U19.D13(IO,_(DIFFIO_RX_T35p,_DIFFOUT_T35p,_DQ3T,__,_T_DQ_5,_T_DQ_5))
FPGA_DDR3_D6: U18.F7(DQ1) U19.C14(IO,_(DIFFIO_TX_T36p,_DIFFOUT_T36p,_DQ3T,__,_T_DQ_6,_T_DQ_6))
FPGA_DDR3_D7: U18.G2(DQ6) U19.A14(IO,_(DIFFIO_TX_T34n,_DIFFOUT_T34n,_DQ3T,__,_T_DQ_7,_T_DQ_7))
FPGA_DDR3_D8: U18.C8(DQ10) U19.E14(IO,_(DIFFIO_RX_T31n,_DIFFOUT_T31n,_DQ2T,_DQ1T,_T_DQ_8,_T_DQ_8))
FPGA_DDR3_D9: U18.A2(DQ13) U19.F15(IO,_(DIFFIO_RX_T31p,_DIFFOUT_T31p,_DQ2T,_DQ1T,_T_DQ_9,_T_DQ_9))
FPGA_DDR3_D10: U18.A7(DQ12) U19.B18(IO,_(DIFFIO_TX_T32p,_DIFFOUT_T32p,_DQ2T,_DQ1T,_T_DQ_10,_T_DQ_10))
FPGA_DDR3_D11: U18.C2(DQ11) U19.A17(IO,_(DIFFIO_TX_T30n,_DIFFOUT_T30n,_DQ2T,_DQ1T,_T_DQ_11,_T_DQ_11))
FPGA_DDR3_D12: U18.D7(DQ8) U19.C15(IO,_(DIFFIO_RX_T27n,_DIFFOUT_T27n,_DQ2T,_DQ1T,_T_DQ_12,_T_DQ_12))
FPGA_DDR3_D13: U18.C3(DQ9) U19.C16(IO,_(DIFFIO_RX_T27p,_DIFFOUT_T27p,_DQ2T,_DQ1T,_T_DQ_13,_T_DQ_13))
FPGA_DDR3_D14: U18.B8(DQ14) U19.B16(IO,_(DIFFIO_TX_T28p,_DIFFOUT_T28p,_DQ2T,_DQ1T,_T_DQ_14,_T_DQ_14))
FPGA_DDR3_D15: U18.A3(DQ15) U19.C18(IO,_(DIFFIO_TX_T26n,_DIFFOUT_T26n,_DQ2T,_DQ1T,_T_DQ_15,_T_DQ_15))
FPGA_DDR3_DQM0: U18.E7(LDM) U19.A15(IO,_(DIFFIO_TX_T34p,_DIFFOUT_T34p,_DQ3T,__,_T_DM_0,_T_DM_0))
FPGA_DDR3_DQM1: U18.D3(UDM) U19.C19(IO,_(DIFFIO_TX_T26p,_DIFFOUT_T26p,_DQ2T,_DQ1T,_T_DM_1,_T_DM_1))
FPGA_DDR3_DQS0: U18.F3(LDQS) U19.H9(IO,_(DIFFIO_RX_T37p,_DIFFOUT_T37p,_DQS3T,__,_T_DQS_0,_T_DQS_0))
FPGA_DDR3_DQS1: U18.C7(UDQS) U19.G12(IO,_(DIFFIO_RX_T29p,_DIFFOUT_T29p,_DQS2T,_DQ1T,_T_DQS_1,_T_DQS_1))
FPGA_DDR3_DQSN0: U18.G3(LDQSn) U19.G8(IO,_(DIFFIO_RX_T37n,_DIFFOUT_T37n,_DQSn3T,__,_T_DQS#_0,_T_DQS#_0))
FPGA_DDR3_DQSN1: U18.B7(UDQSn) U19.H12(IO,_(DIFFIO_RX_T29n,_DIFFOUT_T29n,_DQSn2T,_DQ1T,_T_DQS#_1,_T_DQS#_1))
FPGA_DDR3_ODT: U18.K1(ODT) U19.A13(IO,_(DIFFIO_TX_T38p,_DIFFOUT_T38p,__,__,_T_ODT_0,_T_ODT_0))
FPGA_DDR3_RASn: U18.J3(RASn) U19.A9(IO,_(DIFFIO_TX_T50n,_DIFFOUT_T50n,_DQ5T,__,_T_RAS#))
FPGA_DDR3_RESETn: R180.2 U18.T2(~{RESET}) U19.B22(IO,_(DIFFIO_TX_T22p,_DIFFOUT_T22p,__,__,_T_RESET#,_T_RESET#))
FPGA_DDR3_VREF: C236.1 C245.1 C259.1 C260.1 C271.1 R161.2 R166.1 U18.H1(VREF_DQ) U18.M8(VREFC_CA) ; off-sheet FPGA_DDR3_VREF
FPGA_DDR3_WEn: U18.L3(WEn) U19.E6(IO,_(DIFFIO_TX_T56p,_DIFFOUT_T56p,_DQ5T,__,_T_WE#))
SYS_CLK8: U19.K7(IO,_CLK8p,_FPLL_TL_FBp,_(DIFFIO_RX_T49p,_DIFFOUT_T49p))
SYS_CLK9: R168.2 U19.G10(IO,_CLK9p,_(DIFFIO_RX_T41p,_DIFFOUT_T41p))
SYS_CLK10: U19.H10(IO,_CLK10p,_(DIFFIO_RX_T33p,_DIFFOUT_T33p))
SYS_CLK11: U19.G13(IO,_CLK11p,_(DIFFIO_RX_T25p,_DIFFOUT_T25p))
NetR79_1: R79.1(P1) U18.L8(ZQ)
NetR80_1: R80.1(P1) U19.A12(IO,_RZQ_2,_(DIFFIO_TX_T40n,_DIFFOUT_T40n))
NetR168_1: R168.1 U34.3(OUT)

Not connected (* = marked no-connect by the designer): U18 J1(NC)* J9(NC)* L1(NC)* L9(NC)*; U19 A18(IO,_(DIFFIO_TX_T30p,_DIFFOUT_T30p,__,__,_T_CKE_1,_T_CKE_1))* A20(IO,_(DIFFIO_TX_T24p,_DIFFOUT_T24p,_DQ1T,_DQ1T,_T_DQ_18,_T_DQ_18))* A22(IO,_(DIFFIO_TX_T22n,_DIFFOUT_T22n,_DQ1T,_DQ1T,_T_DQ_19,_T_DQ_19))* B20(IO,_(DIFFIO_TX_T20p,_DIFFOUT_T20p,_DQ1T,_DQ1T,_T_DQ_22,_T_DQ_22))* C20(IO,_(DIFFIO_TX_T18n,_DIFFOUT_T18n,_DQ1T,_DQ1T,_T_DQ_23,_T_DQ_23))* C21(IO,_(DIFFIO_TX_T18p,_DIFFOUT_T18p,_DQ1T,_DQ1T,_T_DM_2,_T_DM_2))* D14(IO,_(DIFFIO_TX_T36n,_DIFFOUT_T36n,_DQ3T,__,_T_ODT_1,_T_ODT_1))* D17(IO,_(DIFFIO_RX_T23n,_DIFFOUT_T23n,_DQ1T,_DQ1T,_T_DQ_16,_T_DQ_16))* D18(IO,_(DIFFIO_RX_T19p,_DIFFOUT_T19p,_DQ1T,_DQ1T,_T_DQ_21,_T_DQ_21))* E16(IO,_(DIFFIO_RX_T23p,_DIFFOUT_T23p,_DQ1T,_DQ1T,_T_DQ_17,_T_DQ_17))* E17(IO,_(DIFFIO_RX_T19n,_DIFFOUT_T19n,_DQ1T,_DQ1T,_T_DQ_20,_T_DQ_20))* G7(IO,_(DIFFIO_RX_T53n,_DIFFOUT_T53n,_DQSn5T,__,_T_CS#_1,_T_CS#_1))* G11(IO,_CLK10n,_(DIFFIO_RX_T33n,_DIFFOUT_T33n)) G14(IO,_(DIFFIO_RX_T21n,_DIFFOUT_T21n,_DQSn1T,_DQSn1T,_T_DQS#_2,_T_DQS#_2))* G15(IO,_(DIFFIO_RX_T21p,_DIFFOUT_T21p,_DQS1T,_DQS1T,_T_DQS_2,_T_DQS_2))* J7(IO,_CLK8n,_FPLL_TL_FBn,_(DIFFIO_RX_T49n,_DIFFOUT_T49n))*

### Notes on the sheet
- Bank 7/8: DDR3 1V5
- Embedded Vision Systems Group
- Title
- School of Electrical and Electronic Engineering
- Date:
- Size
- Document Number
- Sheet
- of
- Rev
- (in symbol 5CGXFC7C6U19C7N, part F) BANK 7A
- (in symbol 5CGXFC7C6U19C7N, part G) BANK 8A

### Library data of the parts
?#14 = Title Block Address(1): UoM title block
C225 C231 C233 C236 C259 C260 C270 C271 C276 = CAP: NON-POLARISED CAP
C245 = 0.001uFCapacitor50V5%0402: Mfr: AVX; PartName: 0.001uF50V5%SMD0402; MfrNum: 04025C102JAT2A; TIIntPartnumber: 1C0093; PN: 0402YC103KAT2A; TN: 207-0054-000; Vendor: Digikey; Cost100: 0.015; Cost10K: 0.007; DescriptiveText: Capacitor 0.001uF 50V 5% 0402
R78 = RES_10K_1/16W_1%_0402: RES 10K OHM 1/16W 5% 0402 SMD; Manufacturer: Rohm Semiconductor; Manufacturer Part Number: MCR01MZPJ103; Power (Watts): 0.063W, 1/16W; Temperature Coefficient: ±200ppm/°C; Category: Resistors; ComponentLink1Description: http://rohmfs.rohm.com/en/products/databook/datasheet/passive/resistor/chip_resistor/mcr_a.pdf; ComponentLink1URL: http://rohmfs.rohm.com/en/products/databook/datasheet/passive/resistor/chip_resistor/mcr_a.pdf; Composition: Thick Film; Features: Automotive AEC-Q200 Qualified; Height: 0.016" (0.40mm); Number of Terminations: 2; Package / Case: 0402 (1005 Metric); Packaging: Digi-Reel®; Pricing 1: 1=0.1, 10=0.019, 25=0.014, 100=0.0078, 250=0.00596, 500=0.00476, 1000=0.0035, 5000=0.00251 (USD); Resistance (Ohms): 10k; RoHS: RoHS Compliant; Size / Dimension: 0.039" L x 0.020" W (1.00mm x 0.50mm); Stock 1: 110842; Supplier 1: Digi-Key; Supplier Device Package: 0402 (1005 Metric); Supplier Part Number 1: RHM10KJDKR-ND; Tolerance: ±5%
R79 R80 = 10KOhmResistor1/16W0402: Resistor 10Kohm 1/16W 5% 0402; PartName: 10Kohm1/16W5%SMD0402; Mfr: Rohm; MfrNum: MCR01MZPJ103; TIIntPartnumber: 1R0168; Vendor: DIGIKEY; Cost100: 0.03; Cost10K: 0.0017; DescriptiveText: Resistor 10Kohm 1/16W 5% 0402; Descriptive_Text: Resistor 10Kohm 1/16W 5% 0402
R161 R166 = RES: RESISTOR
R167 = RESISTOR
R168 = RES: Resistor
R180 = RES_10K_1/16W_1%_0402: RES 1.50K OHM 1/16W 1% 0402 SMD; Manufacturer: Yageo; Manufacturer Part Number: RC0402FR-071K5L; Resistance (Ohms): 1.5k; Power (Watts): 0.063W, 1/16W; Temperature Coefficient: ±100ppm/°C; Supplier 1: Digi-Key; Supplier Part Number 1: 311-1.50KLRDKR-ND; RoHS: RoHS Compliant; Category: Resistors; Stock 1: 433921; Pricing 1: 1=0.1, 10=0.014, 25=0.0104, 100=0.0063, 250=0.0054, 500=0.00382, 1000=0.0027, 2500=0.00234, 5000=0.00203 (USD); Composition: Thick Film; Features: -; Tolerance: ±1%; Package / Case: 0402 (1005 Metric); Supplier Device Package: 0402; Size / Dimension: 0.039" L x 0.020" W (1.00mm x 0.50mm); Height: 0.016" (0.40mm); Number of Terminations: 2; Packaging: Digi-Reel®; ComponentLink1URL: http://www.yageo.com/documents/recent/PYu-RC0402_51_RoHS_L_6.pdf; ComponentLink1Description: http://www.yageo.com/documents/recent/PYu-RC0402_51_RoHS_L_6.pdf
U18 = MT41K256M16HA: DDR2 SDRAM 2Gb (256Mx8); Manufacturer: Micron Technology; Lead Time: 0 weeks; Peak Solder Temperature: 260 deg C; Supplier 1: Arrow; Supplier Part Number 1: 52128708S9959891N2406; Manufacturer Part Number: MT41K256M16HA-125:E; RoHS: CHINA ROHS: Compliant / EU ROHS: Compliant; Stock 1: 0; Pricing 1: 0=10.09 (USD); Package Quantity: 1; Termination Finish: Sn/Ag/Cu; China ROHS Lead (X -> above / O -> below threshold): O; China ROHS Mercury (X -> above / O -> below threshold): O; China ROHS Cadmium (X -> above / O -> below threshold): O; China ROHS Hex Chromium (X -> above / O -> below threshold): O; China ROHS PBB (X -> above / O -> below threshold): O; China ROHS PBDE (X -> above / O -> below threshold): O; EU_ROHS_PROD_EXEMPTION_BY_SUPP: N/R; ComponentLink1URL: http://components.arrow.com/partservice/dataview/altium/52128708S9959891N2406?apiKey=aa438727d59eed98c4bed826d8d949c84cb5e685b92bf87346a0226bd2658797; ComponentLink1Description: http://components.arrow.com/partservice/dataview/altium/52128708S9959891N2406?apiKey=aa438727d59eed98c4bed826d8d949c84cb5e685b92bf87346a0226bd2658797
U19 = 5CGXFC7C6U19C7N: Cyclone V GX Family FPGA, 1.07 to 1.13 V Supply, 240 I/O Pins, 7 PLLs, 484-Pin UBGA, Speed Grade 7, Commercial Grade, RoHS Compliant; Manufacturer: Altera; GPIO: 240; Logic Elements (LE) (K): 149.5; Speed Grade: 7; DatasheetVersion: Rev. 3.4; PackageVersion: Rev. 1.0, 12/2011; PackageReference: UBGA484_A-190; PackageDescription: 484-Pin Ultra FineLine Ball-Grid Array (UBGA), Body 19 x 19 mm, Pitch 0.8 mm; Supplier 1: Digi-Key; Supplier Part Number 1: 5CGXFC7C6U19C7N-ND; Supplier 2: Mouser; Supplier Part Number 2: 989-5CGXFC7C6U19C7N; Device Group: 5CGXFC7; RoHS: RoHS Compliant; Subcategory: Cyclone V GX; Voltage Supply: 1.07 to 1.13 V; NexusDeviceID: 5CGXFC7C6U19C7N; Mounting Technology: Surface Mount; Code_JEDEC: MO-275-PPAA-2; PartNumber: 5CGXFC7C6U19C7N; ComponentLink1Description: Manufacturer URL; ComponentLink1URL: http://www.altera.com; ComponentLink2Description: Datasheet; ComponentLink2URL: http://www.altera.com/literature/hb/cyclone-v/cv_51002.pdf; ComponentLink3Description: Package Specification; ComponentLink3URL: http://www.altera.com/devicepackaging/04R00436-01.pdf; ComponentLink4Description: Device Handbook URL; ComponentLink4URL: http://www.altera.com/literature/hb/cyclone-v/cyclone5_handbook.pdf; ComponentLink5Description: Device Pin-Out URL; ComponentLink5URL: http://www.altera.com/literature/dp/cyclone-v/5CGXFC7.xls; ComponentLink6Description: Device Overview URL; ComponentLink6URL: http://www.altera.com/literature/hb/cyclone-v/cv_51001.pdf; ComponentLink7Description: Product URL; ComponentLink7URL: http://www.buyaltera.com/scripts/partsearch.dll?Detail&name=5CGXFC7C6U19C7N-ND
U34 = OSC: XTAL OSCILLATOR MODULE

## Sheet Pg15_FPGA_5CGX.SchDoc: FPGA CYCLONE III
size A2; DocumentNumber: 15; Revision: C2; SheetNumber: 15; SheetTotal: 16
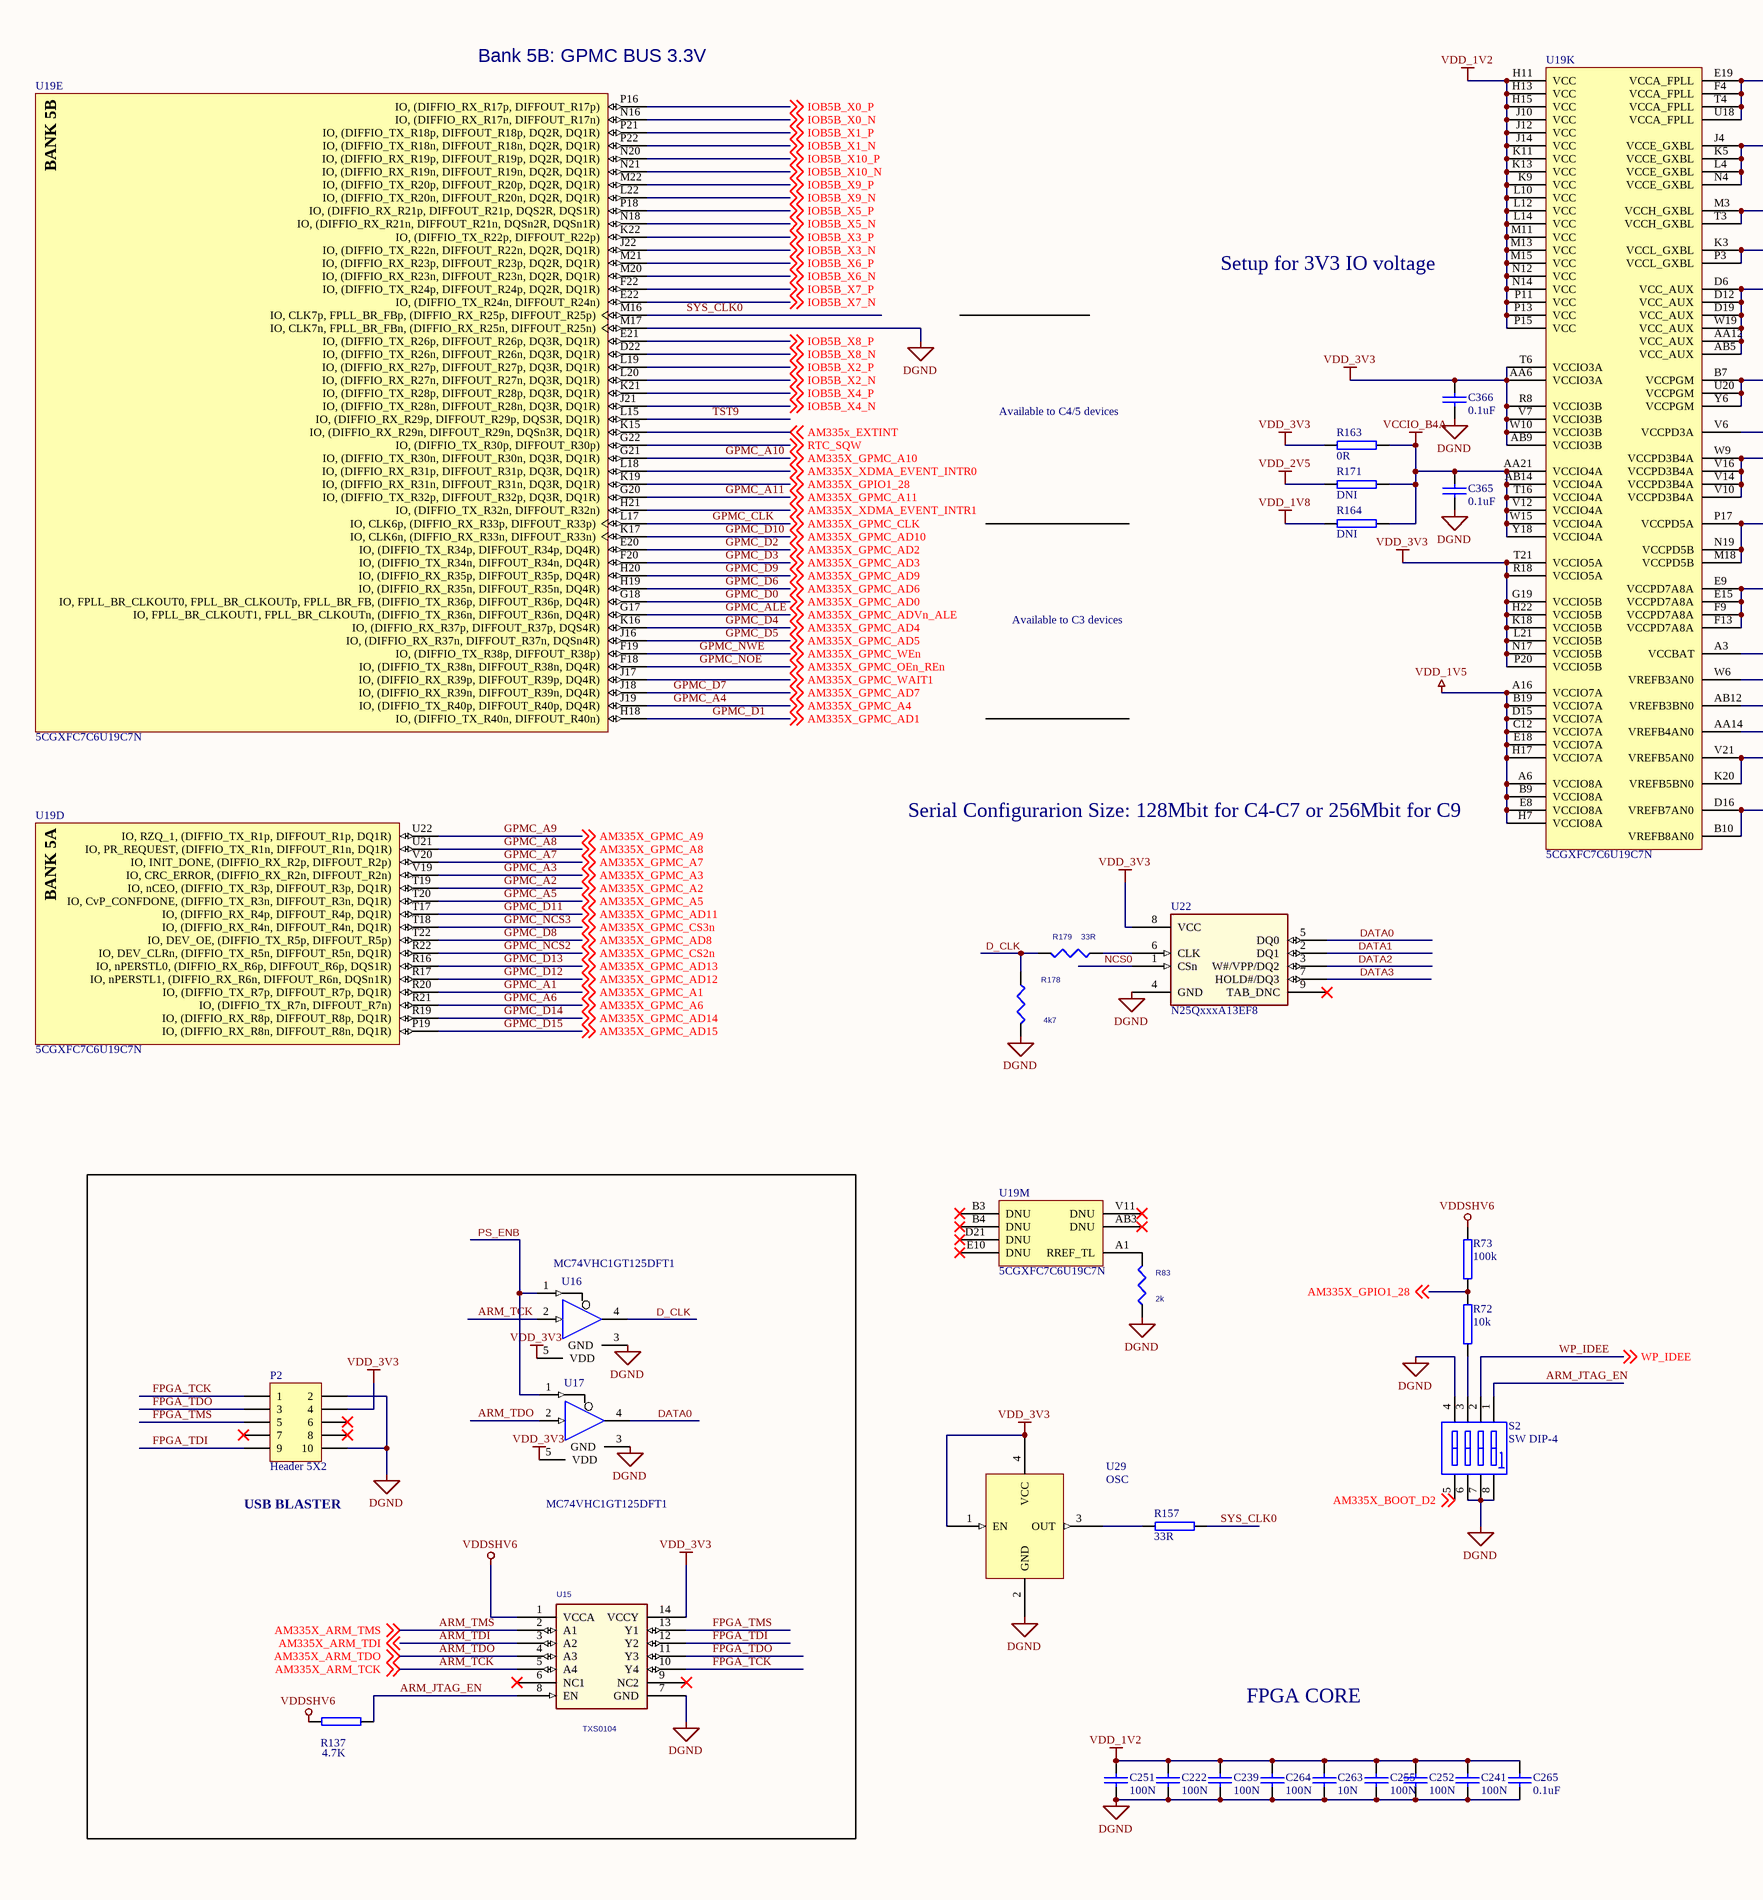
[diagram p17: Pg15_FPGA_5CGX.SchDoc, left]
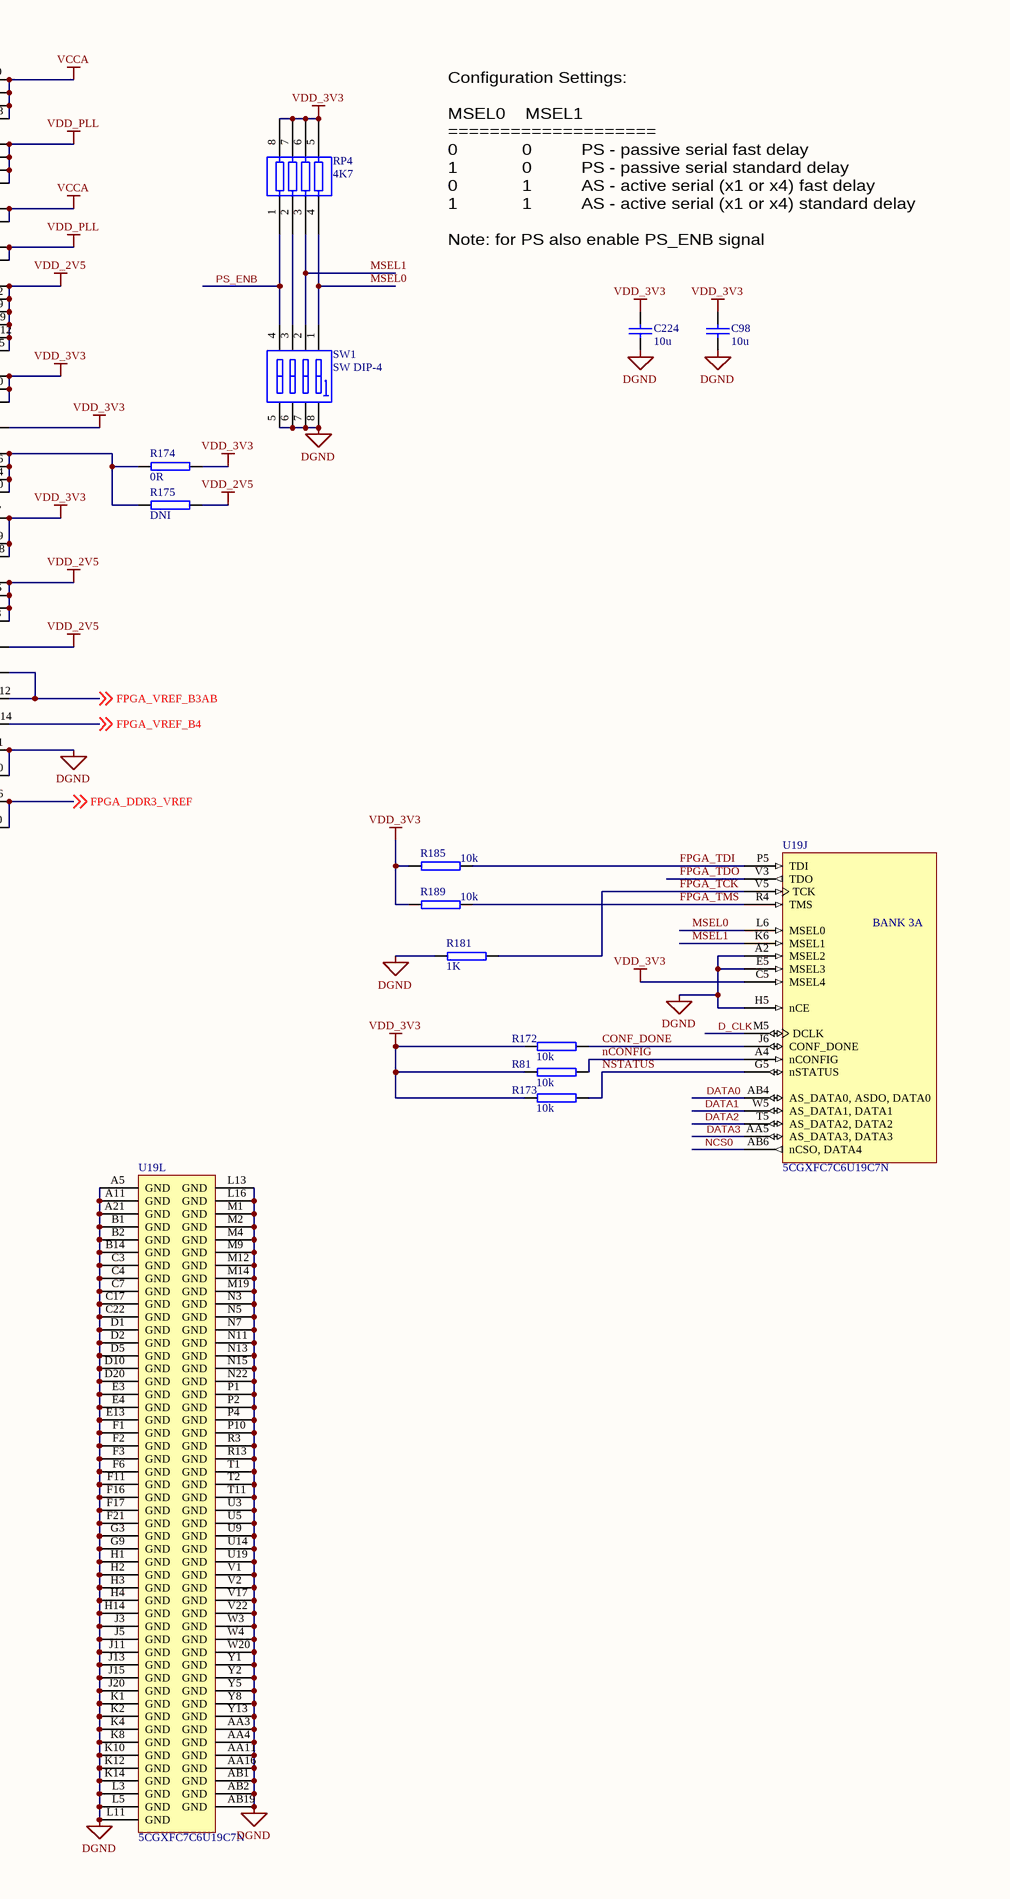
[diagram p18: Pg15_FPGA_5CGX.SchDoc, right]

### Parts
(Parts that share a designator on the sheet are numbered #1, #2 ... from top to bottom, then left to right.)
?#15  (no value)  (graphical)
C98  10u  [0603]
C222  100N  [0603]
C224  10u  [0603]
C239  100N  [sc0402]
C241  100N  [sc0402]
C251  100N  [sc0402]
C252  100N  [sc0402]
C255  100N  [sc0402]
C263  10N  [sc0402]
C264  100N  [sc0402]
C265  0.1uF  [sc0402]
C365  0.1uF  [sc0402]
C366  0.1uF  [sc0402]
P2  Header 5X2  [HDR2X5]
R72  10k  [sc0402]
R73  100k  [sc0402]
R81  10k  [sc0402]
R83  2k  [SM-7351-RES-0402]
R137  4.7K  [sc0402]
R157  33R  [sc0402]
R163  0R  [sc0402]
R164  DNI  [sc0402]
R171  DNI  [sc0402]
R172  10k  [sc0402]
R173  10k  [sc0402]
R174  0R  [sc0402]
R175  DNI  [sc0402]
R178  4k7  [SM-7351-RES-0402]
R179  33R  [SM-7351-RES-0402]
R181  1K  [sc0402]
R185  10k  [sc0402]
R189  10k  [sc0402]
RP4  4K7  [1206X4]
S2  SW DIP-4  [DIPSOP8]
SW1  SW DIP-4  [DIPSOP8]
U15  TXS0104  [RU-14]
U16  MC74VHC1GT125DFT1  [419A-01_N]
U17  MC74VHC1GT125DFT1  [419A-01_N]
U19  5CGXFC7C6U19C7N  [ALTR-UBGA484_A-190]  (parts D,E,J,K,L,M of 13)
U22  N25QxxxA13EF8  [QFN127P600X500X85_HS-9N]
U29  OSC  [Osc 3.2x2.5]

### Blocks framed on the sheet
USB BLASTER: P2 R137 U15-U17

### Nets
DGND: C98.2 C222.2 C224.2 C239.2 C241.2 C251.2 C252.2 C255.2 C263.2 C264.2 C265.2 C365.2 C366.2 P2.2 P2.10 R83.2(P2) R178.1(P1) R181.2 S2.4(A4) S2.6(B3) S2.7(B2) S2.8(B1) SW1.5(B4) SW1.6(B3) SW1.7(B2) SW1.8(B1) U15.7(GND) U16.3(GND) U17.3(GND) U19.A2(MSEL2) U19.A5(GND) U19.A11(GND) U19.A21(GND) U19.AA3(GND) U19.AA4(GND) U19.AA11(GND) U19.AA16(GND) U19.AB1(GND) U19.AB2(GND) U19.AB19(GND) U19.B1(GND) U19.B2(GND) U19.B14(GND) U19.C3(GND) U19.C4(GND) U19.C7(GND) U19.C17(GND) U19.C22(GND) U19.D1(GND) U19.D2(GND) U19.D5(GND) U19.D10(GND) U19.D20(GND) U19.E3(GND) U19.E4(GND) U19.E5(MSEL3) U19.E13(GND) U19.F1(GND) U19.F2(GND) U19.F3(GND) U19.F6(GND) U19.F11(GND) U19.F16(GND) U19.F17(GND) U19.F21(GND) U19.G3(GND) U19.G9(GND) U19.H1(GND) U19.H2(GND) U19.H3(GND) U19.H4(GND) U19.H5(nCE) U19.H14(GND) U19.J3(GND) U19.J5(GND) U19.J11(GND) U19.J13(GND) U19.J15(GND) U19.J20(GND) U19.K1(GND) U19.K2(GND) U19.K4(GND) U19.K8(GND) U19.K10(GND) U19.K12(GND) U19.K14(GND) U19.K20(VREFB5BN0) U19.L3(GND) U19.L5(GND) U19.L11(GND) U19.L13(GND) U19.L16(GND) U19.M1(GND) U19.M2(GND) U19.M4(GND) U19.M9(GND) U19.M12(GND) U19.M14(GND) U19.M17(IO,_CLK7n,_FPLL_BR_FBn,_(DIFFIO_RX_R25n,_DIFFOUT_R25n)) U19.M19(GND) U19.N3(GND) U19.N5(GND) U19.N7(GND) U19.N11(GND) U19.N13(GND) U19.N15(GND) U19.N22(GND) U19.P1(GND) U19.P2(GND) U19.P4(GND) U19.P10(GND) U19.R3(GND) U19.R13(GND) U19.T1(GND) U19.T2(GND) U19.T11(GND) U19.U3(GND) U19.U5(GND) U19.U9(GND) U19.U14(GND) U19.U19(GND) U19.V1(GND) U19.V2(GND) U19.V17(GND) U19.V21(VREFB5AN0) U19.V22(GND) U19.W3(GND) U19.W4(GND) U19.W20(GND) U19.Y1(GND) U19.Y2(GND) U19.Y5(GND) U19.Y8(GND) U19.Y13(GND) U22.4(GND) U29.2(GND)  [also labelled GND]
VCCA: U19.E19(VCCA_FPLL) U19.F4(VCCA_FPLL) U19.M3(VCCH_GXBL) U19.T3(VCCH_GXBL) U19.T4(VCCA_FPLL) U19.U18(VCCA_FPLL)
VCCIO_B4A: C365.1 R163.1 R164.1 R171.1 U19.AA21(VCCIO4A) U19.AB14(VCCIO4A) U19.T16(VCCIO4A) U19.V12(VCCIO4A) U19.W15(VCCIO4A) U19.Y18(VCCIO4A)
VDD: C98.1 C224.1 C366.1 P2.4 R81.2 R163.2 R172.2 R173.2 R174.1 R185.2 R189.2 RP4.5 RP4.6 RP4.7 RP4.8 U15.14(VCCY) U16.5(VDD) U17.5(VDD) U19.AA6(VCCIO3A) U19.AB9(VCCIO3B) U19.B7(VCCPGM) U19.C5(MSEL4) U19.G19(VCCIO5B) U19.H22(VCCIO5B) U19.K18(VCCIO5B) U19.L21(VCCIO5B) U19.M18(VCCPD5B) U19.N17(VCCIO5B) U19.N19(VCCPD5B) U19.P17(VCCPD5A) U19.P20(VCCIO5B) U19.R8(VCCIO3B) U19.R18(VCCIO5A) U19.T6(VCCIO3A) U19.T21(VCCIO5A) U19.U20(VCCPGM) U19.V6(VCCPD3A) U19.V7(VCCIO3B) U19.W10(VCCIO3B) U19.Y6(VCCPGM) U22.8(VCC) U29.1(EN) U29.4(VCC)  [also labelled VDD_3V3]
VDD_1V2: C222.1 C239.1 C241.1 C251.1 C252.1 C255.1 C263.1 C264.1 C265.1 U19.H11(VCC) U19.H13(VCC) U19.H15(VCC) U19.J10(VCC) U19.J12(VCC) U19.J14(VCC) U19.K9(VCC) U19.K11(VCC) U19.K13(VCC) U19.L10(VCC) U19.L12(VCC) U19.L14(VCC) U19.M11(VCC) U19.M13(VCC) U19.M15(VCC) U19.N12(VCC) U19.N14(VCC) U19.P11(VCC) U19.P13(VCC) U19.P15(VCC)
VDD_1V5: U19.A6(VCCIO8A) U19.A16(VCCIO7A) U19.B9(VCCIO8A) U19.B19(VCCIO7A) U19.C12(VCCIO7A) U19.D15(VCCIO7A) U19.E8(VCCIO8A) U19.E18(VCCIO7A) U19.H7(VCCIO8A) U19.H17(VCCIO7A)
VDD_1V8: R164.2
VDD_2V5: R171.2 R175.1 U19.A3(VCCBAT) U19.AA12(VCC_AUX) U19.AB5(VCC_AUX) U19.D6(VCC_AUX) U19.D12(VCC_AUX) U19.D19(VCC_AUX) U19.E9(VCCPD7A8A) U19.E15(VCCPD7A8A) U19.F9(VCCPD7A8A) U19.F13(VCCPD7A8A) U19.W19(VCC_AUX)
VDD_PLL: U19.J4(VCCE_GXBL) U19.K3(VCCL_GXBL) U19.K5(VCCE_GXBL) U19.L4(VCCE_GXBL) U19.N4(VCCE_GXBL) U19.P3(VCCL_GXBL)
VDDSHV6: R73.2 R137.2 U15.1(VCCA)
AM335X_BOOT_D2: S2.5(B4) ; off-sheet AM335X_BOOT_D2
AM335x_EXTINT: U19.K15(IO,_(DIFFIO_RX_R29n,_DIFFOUT_R29n,_DQSn3R,_DQ1R)) ; off-sheet AM335x_EXTINT
AM335X_GPIO1_28: R72.2 R73.1 U19.K19(IO,_(DIFFIO_RX_R31n,_DIFFOUT_R31n,_DQ3R,_DQ1R)) ; off-sheet AM335X_GPIO1_28  [project net TST5]
AM335X_GPMC_WAIT1: U19.J17(IO,_(DIFFIO_RX_R39p,_DIFFOUT_R39p,_DQ4R)) ; off-sheet AM335X_GPMC_WAIT1  [project net GPMC_WAIT1]
AM335X_XDMA_EVENT_INTR0: U19.L18(IO,_(DIFFIO_RX_R31p,_DIFFOUT_R31p,_DQ3R,_DQ1R)) ; off-sheet AM335X_XDMA_EVENT_INTR0
AM335X_XDMA_EVENT_INTR1: U19.H21(IO,_(DIFFIO_TX_R32n,_DIFFOUT_R32n)) ; off-sheet AM335X_XDMA_EVENT_INTR1
ARM_JTAG_EN: R137.1 S2.1(A1) U15.8(EN)
ARM_TCK: U15.5(A4) U16.2(A) ; off-sheet AM335X_ARM_TCK  [also labelled AM335X_ARM_TCK]
ARM_TDI: U15.3(A2) ; off-sheet AM335X_ARM_TDI  [also labelled AM335X_ARM_TDI]
ARM_TDO: U15.4(A3) U17.2(A) ; off-sheet AM335X_ARM_TDO  [also labelled AM335X_ARM_TDO]
ARM_TMS: U15.2(A1) ; off-sheet AM335X_ARM_TMS  [also labelled AM335X_ARM_TMS]
CONF_DONE: R172.1 U19.J6(CONF_DONE)
D_CLK: R178.2(P2) R179.1(P1) U16.4(Y) U19.M5(DCLK)
DATA0: U17.4(Y) U19.AB4(AS_DATA0,_ASDO,_DATA0) U22.5(DQ0)
DATA1: U19.W5(AS_DATA1,_DATA1) U22.2(DQ1)
DATA2: U19.T5(AS_DATA2,_DATA2) U22.3(W#/VPP/DQ2)
DATA3: U19.AA5(AS_DATA3,_DATA3) U22.7(HOLD#/DQ3)
FPGA_DDR3_VREF: U19.B10(VREFB8AN0) U19.D16(VREFB7AN0) ; off-sheet FPGA_DDR3_VREF
FPGA_TCK: P2.1 R181.1 U15.10(Y4) U19.V5(TCK)
FPGA_TDI: P2.9 R185.1 U15.12(Y2) U19.P5(TDI)
FPGA_TDO: P2.3 U15.11(Y3) U19.V3(TDO)
FPGA_TMS: P2.5 R189.1 U15.13(Y1) U19.R4(TMS)
FPGA_VREF_B3AB: U19.AB12(VREFB3BN0) U19.W6(VREFB3AN0) ; off-sheet FPGA_VREF_B3AB
FPGA_VREF_B4: U19.AA14(VREFB4AN0) ; off-sheet FPGA_VREF_B4
GPMC_A1: U19.R20(IO,_(DIFFIO_TX_R7p,_DIFFOUT_R7p,_DQ1R)) ; off-sheet AM335X_GPMC_A1  [also labelled AM335X_GPMC_A1]
GPMC_A2: U19.T19(IO,_nCEO,_(DIFFIO_TX_R3p,_DIFFOUT_R3p,_DQ1R)) ; off-sheet AM335X_GPMC_A2  [also labelled AM335X_GPMC_A2]
GPMC_A3: U19.V19(IO,_CRC_ERROR,_(DIFFIO_RX_R2n,_DIFFOUT_R2n)) ; off-sheet AM335X_GPMC_A3  [also labelled AM335X_GPMC_A3]
GPMC_A4: U19.J19(IO,_(DIFFIO_TX_R40p,_DIFFOUT_R40p,_DQ4R)) ; off-sheet AM335X_GPMC_A4  [also labelled AM335X_GPMC_A4]
GPMC_A5: U19.T20(IO,_CvP_CONFDONE,_(DIFFIO_TX_R3n,_DIFFOUT_R3n,_DQ1R)) ; off-sheet AM335X_GPMC_A5  [also labelled AM335X_GPMC_A5]
GPMC_A6: U19.R21(IO,_(DIFFIO_TX_R7n,_DIFFOUT_R7n)) ; off-sheet AM335X_GPMC_A6  [also labelled AM335X_GPMC_A6]
GPMC_A7: U19.V20(IO,_INIT_DONE,_(DIFFIO_RX_R2p,_DIFFOUT_R2p)) ; off-sheet AM335X_GPMC_A7  [also labelled AM335X_GPMC_A7]
GPMC_A8: U19.U21(IO,_PR_REQUEST,_(DIFFIO_TX_R1n,_DIFFOUT_R1n,_DQ1R)) ; off-sheet AM335X_GPMC_A8  [also labelled AM335X_GPMC_A8]
GPMC_A9: U19.U22(IO,_RZQ_1,_(DIFFIO_TX_R1p,_DIFFOUT_R1p,_DQ1R)) ; off-sheet AM335X_GPMC_A9  [also labelled AM335X_GPMC_A9]
GPMC_A10: U19.G21(IO,_(DIFFIO_TX_R30n,_DIFFOUT_R30n,_DQ3R,_DQ1R)) ; off-sheet AM335X_GPMC_A10  [also labelled AM335X_GPMC_A10]
GPMC_A11: U19.G20(IO,_(DIFFIO_TX_R32p,_DIFFOUT_R32p,_DQ3R,_DQ1R)) ; off-sheet AM335X_GPMC_A11  [also labelled AM335X_GPMC_A11]
GPMC_ALE: U19.G17(IO,_FPLL_BR_CLKOUT1,_FPLL_BR_CLKOUTn,_(DIFFIO_TX_R36n,_DIFFOUT_R36n,_DQ4R)) ; off-sheet AM335X_GPMC_ADVn_ALE  [also labelled AM335X_GPMC_ADVn_ALE]
GPMC_CLK: U19.L17(IO,_CLK6p,_(DIFFIO_RX_R33p,_DIFFOUT_R33p)) ; off-sheet AM335X_GPMC_CLK  [also labelled AM335X_GPMC_CLK]
GPMC_D0: U19.G18(IO,_FPLL_BR_CLKOUT0,_FPLL_BR_CLKOUTp,_FPLL_BR_FB,_(DIFFIO_TX_R36p,_DIFFOUT_R36p,_DQ4R)) ; off-sheet AM335X_GPMC_AD0  [also labelled AM335X_GPMC_AD0]
GPMC_D1: U19.H18(IO,_(DIFFIO_TX_R40n,_DIFFOUT_R40n)) ; off-sheet AM335X_GPMC_AD1  [also labelled AM335X_GPMC_AD1]
GPMC_D2: U19.E20(IO,_(DIFFIO_TX_R34p,_DIFFOUT_R34p,_DQ4R)) ; off-sheet AM335X_GPMC_AD2  [also labelled AM335X_GPMC_AD2]
GPMC_D3: U19.F20(IO,_(DIFFIO_TX_R34n,_DIFFOUT_R34n,_DQ4R)) ; off-sheet AM335X_GPMC_AD3  [also labelled AM335X_GPMC_AD3]
GPMC_D4: U19.K16(IO,_(DIFFIO_RX_R37p,_DIFFOUT_R37p,_DQS4R)) ; off-sheet AM335X_GPMC_AD4  [also labelled AM335X_GPMC_AD4]
GPMC_D5: U19.J16(IO,_(DIFFIO_RX_R37n,_DIFFOUT_R37n,_DQSn4R)) ; off-sheet AM335X_GPMC_AD5  [also labelled AM335X_GPMC_AD5]
GPMC_D6: U19.H19(IO,_(DIFFIO_RX_R35n,_DIFFOUT_R35n,_DQ4R)) ; off-sheet AM335X_GPMC_AD6  [also labelled AM335X_GPMC_AD6]
GPMC_D7: U19.J18(IO,_(DIFFIO_RX_R39n,_DIFFOUT_R39n,_DQ4R)) ; off-sheet AM335X_GPMC_AD7  [also labelled AM335X_GPMC_AD7]
GPMC_D8: U19.T22(IO,_DEV_OE,_(DIFFIO_TX_R5p,_DIFFOUT_R5p)) ; off-sheet AM335X_GPMC_AD8  [also labelled AM335X_GPMC_AD8]
GPMC_D9: U19.H20(IO,_(DIFFIO_RX_R35p,_DIFFOUT_R35p,_DQ4R)) ; off-sheet AM335X_GPMC_AD9  [also labelled AM335X_GPMC_AD9]
GPMC_D10: U19.K17(IO,_CLK6n,_(DIFFIO_RX_R33n,_DIFFOUT_R33n)) ; off-sheet AM335X_GPMC_AD10  [also labelled AM335X_GPMC_AD10]
GPMC_D11: U19.T17(IO,_(DIFFIO_RX_R4p,_DIFFOUT_R4p,_DQ1R)) ; off-sheet AM335X_GPMC_AD11  [also labelled AM335X_GPMC_AD11]
GPMC_D12: U19.R17(IO,_nPERSTL1,_(DIFFIO_RX_R6n,_DIFFOUT_R6n,_DQSn1R)) ; off-sheet AM335X_GPMC_AD12  [also labelled AM335X_GPMC_AD12]
GPMC_D13: U19.R16(IO,_nPERSTL0,_(DIFFIO_RX_R6p,_DIFFOUT_R6p,_DQS1R)) ; off-sheet AM335X_GPMC_AD13  [also labelled AM335X_GPMC_AD13]
GPMC_D14: U19.R19(IO,_(DIFFIO_RX_R8p,_DIFFOUT_R8p,_DQ1R)) ; off-sheet AM335X_GPMC_AD14  [also labelled AM335X_GPMC_AD14]
GPMC_D15: U19.P19(IO,_(DIFFIO_RX_R8n,_DIFFOUT_R8n,_DQ1R)) ; off-sheet AM335X_GPMC_AD15  [also labelled AM335X_GPMC_AD15]
GPMC_NCS2: U19.R22(IO,_DEV_CLRn,_(DIFFIO_TX_R5n,_DIFFOUT_R5n,_DQ1R)) ; off-sheet AM335X_GPMC_CS2n  [also labelled AM335X_GPMC_CS2n]
GPMC_NCS3: U19.T18(IO,_(DIFFIO_RX_R4n,_DIFFOUT_R4n,_DQ1R)) ; off-sheet AM335X_GPMC_CS3n  [also labelled AM335X_GPMC_CS3n]
GPMC_NOE: U19.F18(IO,_(DIFFIO_TX_R38n,_DIFFOUT_R38n,_DQ4R)) ; off-sheet AM335X_GPMC_OEn_REn  [also labelled AM335X_GPMC_OEn_REn]
GPMC_NWE: U19.F19(IO,_(DIFFIO_TX_R38p,_DIFFOUT_R38p)) ; off-sheet AM335X_GPMC_WEn  [also labelled AM335X_GPMC_WEn]
IOB5B_X0_N: U19.N16(IO,_(DIFFIO_RX_R17n,_DIFFOUT_R17n)) ; off-sheet IOB5B_X0_N
IOB5B_X0_P: U19.P16(IO,_(DIFFIO_RX_R17p,_DIFFOUT_R17p)) ; off-sheet IOB5B_X0_P
IOB5B_X1_N: U19.P22(IO,_(DIFFIO_TX_R18n,_DIFFOUT_R18n,_DQ2R,_DQ1R)) ; off-sheet IOB5B_X1_N
IOB5B_X1_P: U19.P21(IO,_(DIFFIO_TX_R18p,_DIFFOUT_R18p,_DQ2R,_DQ1R)) ; off-sheet IOB5B_X1_P
IOB5B_X2_N: U19.L20(IO,_(DIFFIO_RX_R27n,_DIFFOUT_R27n,_DQ3R,_DQ1R)) ; off-sheet IOB5B_X2_N
IOB5B_X2_P: U19.L19(IO,_(DIFFIO_RX_R27p,_DIFFOUT_R27p,_DQ3R,_DQ1R)) ; off-sheet IOB5B_X2_P
IOB5B_X3_N: U19.J22(IO,_(DIFFIO_TX_R22n,_DIFFOUT_R22n,_DQ2R,_DQ1R)) ; off-sheet IOB5B_X3_N
IOB5B_X3_P: U19.K22(IO,_(DIFFIO_TX_R22p,_DIFFOUT_R22p)) ; off-sheet IOB5B_X3_P
IOB5B_X4_N: U19.J21(IO,_(DIFFIO_TX_R28n,_DIFFOUT_R28n,_DQ3R,_DQ1R)) ; off-sheet IOB5B_X4_N
IOB5B_X4_P: U19.K21(IO,_(DIFFIO_TX_R28p,_DIFFOUT_R28p,_DQ3R,_DQ1R)) ; off-sheet IOB5B_X4_P
IOB5B_X5_N: U19.N18(IO,_(DIFFIO_RX_R21n,_DIFFOUT_R21n,_DQSn2R,_DQSn1R)) ; off-sheet IOB5B_X5_N
IOB5B_X5_P: U19.P18(IO,_(DIFFIO_RX_R21p,_DIFFOUT_R21p,_DQS2R,_DQS1R)) ; off-sheet IOB5B_X5_P
IOB5B_X6_N: U19.M20(IO,_(DIFFIO_RX_R23n,_DIFFOUT_R23n,_DQ2R,_DQ1R)) ; off-sheet IOB5B_X6_N
IOB5B_X6_P: U19.M21(IO,_(DIFFIO_RX_R23p,_DIFFOUT_R23p,_DQ2R,_DQ1R)) ; off-sheet IOB5B_X6_P
IOB5B_X7_N: U19.E22(IO,_(DIFFIO_TX_R24n,_DIFFOUT_R24n)) ; off-sheet IOB5B_X7_N
IOB5B_X7_P: U19.F22(IO,_(DIFFIO_TX_R24p,_DIFFOUT_R24p,_DQ2R,_DQ1R)) ; off-sheet IOB5B_X7_P
IOB5B_X8_N: U19.D22(IO,_(DIFFIO_TX_R26n,_DIFFOUT_R26n,_DQ3R,_DQ1R)) ; off-sheet IOB5B_X8_N
IOB5B_X8_P: U19.E21(IO,_(DIFFIO_TX_R26p,_DIFFOUT_R26p,_DQ3R,_DQ1R)) ; off-sheet IOB5B_X8_P
IOB5B_X9_N: U19.L22(IO,_(DIFFIO_TX_R20n,_DIFFOUT_R20n,_DQ2R,_DQ1R)) ; off-sheet IOB5B_X9_N
IOB5B_X9_P: U19.M22(IO,_(DIFFIO_TX_R20p,_DIFFOUT_R20p,_DQ2R,_DQ1R)) ; off-sheet IOB5B_X9_P
IOB5B_X10_N: U19.N21(IO,_(DIFFIO_RX_R19n,_DIFFOUT_R19n,_DQ2R,_DQ1R)) ; off-sheet IOB5B_X10_N
IOB5B_X10_P: U19.N20(IO,_(DIFFIO_RX_R19p,_DIFFOUT_R19p,_DQ2R,_DQ1R)) ; off-sheet IOB5B_X10_P
MSEL0: RP4.4 SW1.1(A1) U19.L6(MSEL0)
MSEL1: RP4.3 SW1.2(A2) U19.K6(MSEL1)
nCONFIG: R81.1 U19.A4(nCONFIG)
NCS0: U19.AB6(nCSO,_DATA4) U22.1(CSn)
NSTATUS: R173.1 U19.G5(nSTATUS)
PS_ENB: RP4.1 SW1.4(A4) U16.1(~{OE}) U17.1(~{OE})
RTC_SQW: U19.G22(IO,_(DIFFIO_TX_R30p,_DIFFOUT_R30p)) ; off-sheet RTC_SQW
SYS_CLK0: R157.2 U19.M16(IO,_CLK7p,_FPLL_BR_FBp,_(DIFFIO_RX_R25p,_DIFFOUT_R25p))
TST9: U19.L15(IO,_(DIFFIO_RX_R29p,_DIFFOUT_R29p,_DQS3R,_DQ1R))
WP_IDEE: S2.2(A2) ; off-sheet WP_IDEE
NetR72_1: R72.1 S2.3(A3)
NetR83_1: R83.1(P1) U19.A1(RREF_TL)
NetR157_1: R157.1 U29.3(OUT)
NetR174_2: R174.2 R175.2 U19.V10(VCCPD3B4A) U19.V14(VCCPD3B4A) U19.V16(VCCPD3B4A) U19.W9(VCCPD3B4A)
NetR179_2: R179.2(P2) U22.6(CLK)
NetRP4_2: RP4.2 SW1.3(A3)

Not connected (* = marked no-connect by the designer): P2 6* 7* 8*; U15 6(NC1)* 9(NC2)*; U19 AB3(DNU)* B3(DNU)* B4(DNU)* D21(DNU)* E10(DNU)* V11(DNU)*; U22 9(TAB_DNC)*

### Notes on the sheet
- (near U19) Bank 5B: GPMC BUS 3.3V
- Setup for 3V3 IO voltage
- Configuration Settings:
  MSEL0    MSEL1
  ====================
  0             0          PS - passive serial fast delay
  1             0          PS - passive serial standard delay
  0             1          AS - active serial (x1 or x4) fast delay
  1             1          AS - active serial (x1 or x4) standard delay
  Note: for PS also enable PS_ENB signal
- Available to C4/5 devices
- Available to C3 devices
- (near U19) Serial Configurarion Size: 128Mbit for C4-C7 or 256Mbit for C9
- BANK 3A
- FPGA CORE
- Embedded Vision Systems Group
- Title
- School of Electrical and Electronic Engineering
- Date:
- Size
- Document Number
- Sheet
- of
- Rev
- (in symbol 5CGXFC7C6U19C7N, part D) BANK 5A
- (in symbol 5CGXFC7C6U19C7N, part E) BANK 5B

### Library data of the parts
?#15 = Title Block Address(1): UoM title block
C98 C222 C224 C239 C241 C251 C252 C255 C263-C265 C365 C366 = CAP: NON-POLARISED CAP
P2 = Header 5X2: Header, 5-Pin, Dual row; LatestRevisionDate: 17-Jul-2002; LatestRevisionNote: Re-released for DXP Platform.; Publisher: Altium Limited
R72 R73 R81 R157 R163 R164 R171-R175 R181 R185 R189 = RES: Resistor
R83 R178 R179 = 10KOhmResistor1/16W0402: as R79 on sheet Pg14_FPGA_DDR3; DescriptiveText: Resistor 10Kohm 1/16W 5% 0402; Descriptive_Text: Resistor 10Kohm 1/16W 5% 0402
R137 = RES: RESISTOR
RP4 = RESDIP4: QUAD DIP RESISTOR PACK; Part Field 1: 1; Part Field 10: 1000u; Part Field 2: 0; Part Field 3: 0; Part Field 4: 0; Part Field 5: 1; Part Field 6: 1000K; Part Field 7: 1u; Part Field 8: 1u; Part Field 9: 500u
S2 SW1 = SW DIP-4: DIP Switch, 4 Position, SPST; Published: 24-Mar-1999; LatestRevisionDate: 29-May-2009; LatestRevisionNote: IPC-7351 Footprint Added.; PackageReference: SO8; Publisher: Altium Limited; Code_JEDEC: MS-012-AA; Code_IPC: SOIC127P600-8; PackageVersion: Dec-2002; PackageDescription: 8-Pin Small Outline Integrated Circuit 1.27 mm Pitch
U15 = ADG3304: IC - LOW VOLTAGE 1.2 V TO 5.5 V, 4 CHANNEL, BIDIRECTIONAL, LOGIC LEVEL TRANSLATOR, 14-TSSOP; Manufacturer Part Num: ADG3304BRUZ; Manufacturer: Analog Devices; Item Num: P01-14850R; Lead Free Status: Yew
U16 U17 = MC74VHC1GT125DFT1: Non-Inverting Buffer / CMOS Logic Level Shifter with LSTTL-Compatible Inputs; Published: 15-Apr-2002; LatestRevisionDate: 12-Dec-2006; LatestRevisionNote: IPC-7351 Footprint Added.; DatasheetVersion: Feb-2000; PackageVersion: Oct-1999; PackageReference: 419A-01; Publisher: Altium Limited; PackageDescription: 5-Pin SOT-353 Package 0.65 mm Pitch, 2.1 mm Lead Span; ComponentLink1Description: Manufacturer Link; ComponentLink1URL: http://www.onsemi.com/
U19 = 5CGXFC7C6U19C7N: as U19 on sheet Pg14_FPGA_DDR3; DatasheetVersion: Rev. 3.4; PackageVersion: Rev. 1.0, 12/2011; PackageReference: UBGA484_A-190; PackageDescription: 484-Pin Ultra FineLine Ball-Grid Array (UBGA), Body 19 x 19 mm, Pitch 0.8 mm; Supplier 1: Digi-Key; Supplier Part Number 1: 5CGXFC7C6U19C7N-ND; Supplier 2: Mouser; Supplier Part Number 2: 989-5CGXFC7C6U19C7N; Device Group: 5CGXFC7; RoHS: RoHS Compliant; Subcategory: Cyclone V GX; Voltage Supply: 1.07 to 1.13 V; NexusDeviceID: 5CGXFC7C6U19C7N; Mounting Technology: Surface Mount; Code_JEDEC: MO-275-PPAA-2; PartNumber: 5CGXFC7C6U19C7N; ComponentLink1Description: Manufacturer URL; ComponentLink1URL: http://www.altera.com; ComponentLink2Description: Datasheet; ComponentLink2URL: http://www.altera.com/literature/hb/cyclone-v/cv_51002.pdf; ComponentLink3Description: Package Specification; ComponentLink3URL: http://www.altera.com/devicepackaging/04R00436-01.pdf; ComponentLink4Description: Device Handbook URL; ComponentLink4URL: http://www.altera.com/literature/hb/cyclone-v/cyclone5_handbook.pdf; ComponentLink5Description: Device Pin-Out URL; ComponentLink5URL: http://www.altera.com/literature/dp/cyclone-v/5CGXFC7.xls; ComponentLink6Description: Device Overview URL; ComponentLink6URL: http://www.altera.com/literature/hb/cyclone-v/cv_51001.pdf; ComponentLink7Description: Product URL; ComponentLink7URL: http://www.buyaltera.com/scripts/partsearch.dll?Detail&name=5CGXFC7C6U19C7N-ND
U29 = OSC: XTAL OSCILLATOR MODULE